# Altium project Learning stand.PrjPcb (part 1 of 2)
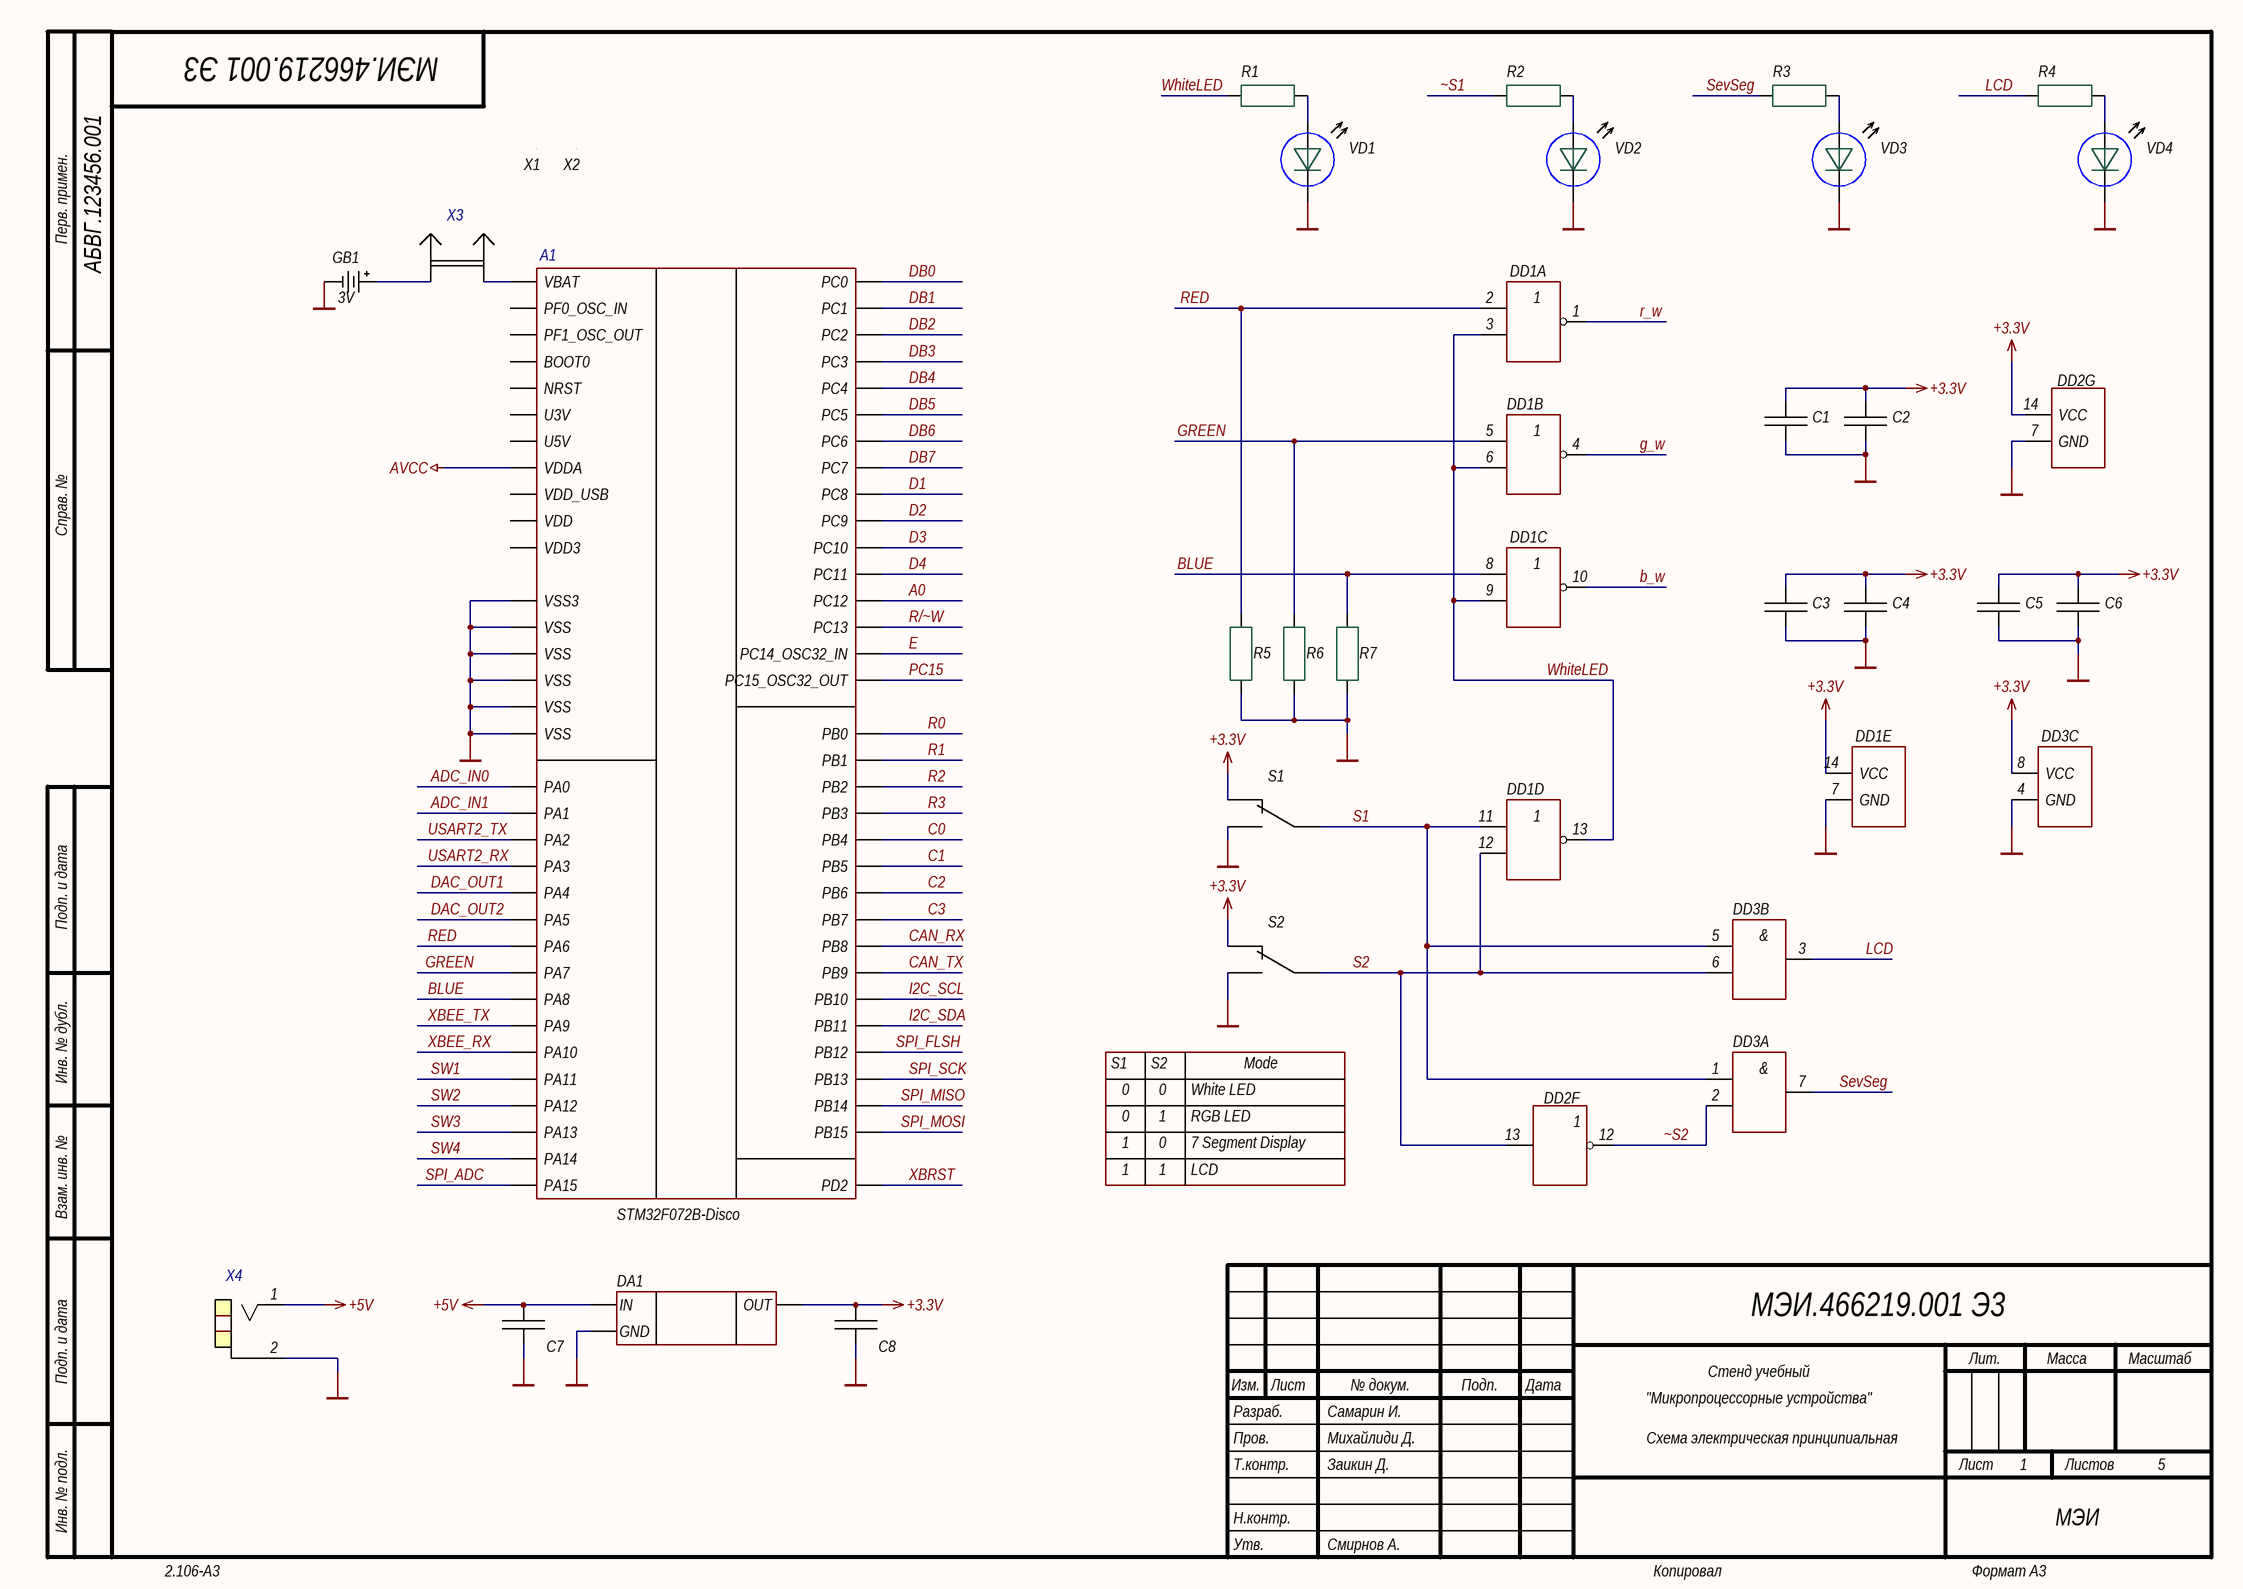
[diagram p0: Microcontroller.SchDoc]
5 sheets, 280 parts. Net scope: global (net labels, ports and power ports of the same name join across sheets).
Board file: PCB.PcbDoc
Sheets:
  Microcontroller.SchDoc
  Peripherals.SchDoc
  Communication.SchDoc
  Displays.SchDoc
  LEDs.SchDoc

## Sheet Microcontroller.SchDoc: Стенд учебный
size 420 x 297 mm; ApprovedBy: Смирнов А.; CheckedBy: Михайлиди Д.; Author: Самарин И.; CompanyName: МЭИ; Address1: Address1; Address2: Address2; Address3: Address3; Address4: Address4; DocumentNumber: МЭИ.466219.001 Э3; SheetNumber: 1; SheetTotal: 5; Title2str: "Микропроцессорные устройства"; ProcessInspection: Заикин Д.; DocumentType: Схема электрическая принципиальная; FirstReferrence: АБВГ.123456.001

### Parts
A1  STM32F072B-Disco  [STM32F072B-Disco]
C1  approved sub OK  [CAPC1608X90N]  (value not drawn)
C2  approved sub OK  [CAPC1608X90N]  (value not drawn)
C3  approved sub OK  [CAPC1608X90N]  (value not drawn)
C4  approved sub OK  [CAPC1608X90N]  (value not drawn)
C5  approved sub OK  [CAPC1608X90N]  (value not drawn)
C6  approved sub OK  [CAPC1608X90N]  (value not drawn)
C7  approved sub OK  [CAPC1608X90N]  (value not drawn)
C8  approved sub OK  [CAPC1608X90N]  (value not drawn)
DA1  ADP3339AKCZ-3.3-RL7  [SOT223]  (value not drawn)
DD1  74LV02D.112  [SOIC127P600X175-14AN]  (value not drawn)  (parts A,B,C,D,E of 5)
DD2  SN74AHCU04DR  [SOIC127P780X200-14N]  (value not drawn)  (parts F,G of 7)
DD3  74LVC2G08DP.125  [TSSOP65P400X110-8N]  (value not drawn)  (parts A,B,C of 3)
GB1  3V  [HU2032-1]
R1  Thick Film  [RESC1608X55N]  (value not drawn)
R2  Thick Film  [RESC1608X55N]  (value not drawn)
R3  Thick Film  [RESC1608X55N]  (value not drawn)
R4  Thick Film  [RESC1608X55N]  (value not drawn)
R5  Thick Film  [RESC1608X55N]  (value not drawn)
R6  Thick Film  [RESC1608X55N]  (value not drawn)
R7  Thick Film  [RESC1608X55N]  (value not drawn)
S1  ON-ON  [SWITCH_SPDT_SLIDER]  (value not drawn)
S2  ON-ON  [SWITCH_SPDT_SLIDER]  (value not drawn)
VD1  FYLS-0603URC  [LED-0603-GREEN]  (value not drawn)
VD2  FYLS-0603URC  [LED-0603-GREEN]  (value not drawn)
VD3  FYLS-0603URC  [LED-0603-GREEN]  (value not drawn)
VD4  FYLS-0603URC  [LED-0603-GREEN]  (value not drawn)
X1  PBS-40  [PBS33]  (value not drawn)
X2  PBS-40  [PBS33]  (value not drawn)
X3  PLS-2  [HDR_1x2]  (value not drawn)
X4  PJ-002A  [CONN_PWR_JACK_2.1x5.5mm]  (value not drawn)

### Nets
+3.3V: C1.1 C2.1 C3.1 C4.1 C5.1 C6.1 C8.1 DA1.2(OUT) DD1.14(VCC) DD2.14(VCC) DD3.8(VCC) S1.3 S2.3
+5V: C7.1 DA1.3(IN) X4.1(VCC)
AVCC: A1.P2_19(VDDA)
GND: A1.P1_2(VSS) A1.P1_9(VSS) A1.P1_19(VSS3) A1.P1_33(VSS) A1.P2_2(VSS) A1.P2_33(VSS) C1.2 C2.2 C3.2 C4.2 C5.2 C6.2 C7.2 C8.2 DA1.1(GND) DD1.7(GND) DD2.7(GND) DD3.4(GND) GB1.GND(MINUS) R5.1 R6.1 R7.1 S1.1 S2.1 VD1.K VD2.K VD3.K VD4.K X4.2(GND)
A0: A1.P2_13(PC12)
ADC_IN0: A1.P1_15(PA0)
ADC_IN1: A1.P1_16(PA1)
b_w: DD1.10(3Y)
BLUE: A1.P2_25(PA8) DD1.8(3A) R7.2
C0: A1.P2_10(PB4)
C1: A1.P2_9(PB5)
C2: A1.P2_8(PB6)
C3: A1.P2_7(PB7)
CAN_RX: A1.P2_4(PB8)
CAN_TX: A1.P2_3(PB9)
D1: A1.P2_27(PC8)
D2: A1.P2_26(PC9)
D3: A1.P2_15(PC10)
D4: A1.P2_14(PC11)
DAC_OUT1: A1.P1_21(PA4)
DAC_OUT2: A1.P1_22(PA5)
DB0: A1.P1_11(PC0)
DB1: A1.P1_12(PC1)
DB2: A1.P1_13(PC2)
DB3: A1.P1_14(PC3)
DB4: A1.P1_25(PC4)
DB5: A1.P1_26(PC5)
DB6: A1.P2_29(PC6)
DB7: A1.P2_28(PC7)
E: A1.P1_5(PC14_OSC32_IN)
g_w: DD1.4(2Y)
GREEN: A1.P1_24(PA7) DD1.5(2A) R6.2
I2C_SCL: A1.P1_30(PB10)
I2C_SDA: A1.P1_31(PB11)
LCD: DD3.3(2Y) R4.1
PC15: A1.P1_6(PC15_OSC32_OUT)
R0: A1.P1_27(PB0)
R1: A1.P1_28(PB1)
R2: A1.P1_29(PB2)
R3: A1.P2_11(PB3)
R/~W: A1.P1_4(PC13)
r_w: DD1.1(1Y)
RED: A1.P1_23(PA6) DD1.2(1A) R5.2
S1: DD1.11(4A) DD3.1(1A) DD3.5(2A) S1.2
S2: DD1.12(4B) DD2.13(6A) DD3.6(2B) S2.2
SevSeg: DD3.7(1Y) R3.1
SPI_ADC: A1.P2_16(PA15)
SPI_FLSH: A1.P1_32(PB12)
SPI_MISO: A1.P2_31(PB14)
SPI_MOSI: A1.P2_30(PB15)
SPI_SCK: A1.P2_32(PB13)
SW1: A1.P2_22(PA11)
SW2: A1.P2_21(PA12)
SW3: A1.P2_20(PA13)
SW4: A1.P2_17(PA14)
USART2_RX: A1.P1_18(PA3)
USART2_TX: A1.P1_17(PA2)
WhiteLED: DD1.3(1B) DD1.6(2A) DD1.9(3B) DD1.13(4Y) R1.1
XBEE_RX: A1.P2_23(PA10)
XBEE_TX: A1.P2_24(PA9)
XBRST: A1.P2_12(PD2)
~S1: R2.1
~S2: DD2.12(6Y) DD3.2(1B)
NetA1_P1_3: A1.P1_3(VBAT) X3.2
NetGB1_VCC: GB1.VCC(PLUS) X3.1
NetR1_2: R1.2 VD1.A(AR)
NetR2_2: R2.2 VD2.A(AR)
NetR3_2: R3.2 VD3.A(AR)
NetR4_2: R4.2 VD4.A(AR)

Not connected (* = marked no-connect by the designer): A1 P1_1(U3V) P1_7(PF0_OSC_IN) P1_8(PF1_OSC_OUT) P1_10(NRST) P1_20(VDD3) P2_1(U5V) P2_5(VDD) P2_6(BOOT0) P2_18(VDD_USB); X1 1(VCC); X2 1(VCC)

### Notes on the sheet
- S1
- S2
- Mode
- 0
- 1
- White LED
- RGB LED
- 7 Segment Display
- LCD
- Перв. примен.
- Справ. №
- Подп. и дата
- Инв. № дубл.
- Взам. инв. №
- Разраб.
- Изм.
- Лист
- № докум.
- Подп.
- Дата
- Лит.
- Масса
- Масштаб
- Пров.
- Т.контр.
- Листов
- Инв. № подл.
- Утв.
- Н.контр.
- 2.106-A3
- Копировал
- Формат А3
- (in symbol 74LVC2G08DP.125, part A) &
- (in symbol 74LVC2G08DP.125, part B) &

### Library data of the parts
A1 = STM32F072B-Disco: The STM32F072 discovery kit; Model: STM32F072B-Disco; ComponentLink1Description: Documentation; ComponentLink1URL: https://www.st.com/content/ccc/resource/technical/document/user_manual/3b/8d/46/57/b7/a9/49/b4/DM00099401.pdf/files/DM00099401.pdf/jcr:content/translations/en.DM00099401.pdf; ComponentLink2Description: KOMPEL; ComponentLink2URL: https://www.compel.ru/infosheet/ST/STM32F072B-DISCO
C1 C3 C5 = CAPC_100n_0603_X7R_50V_10%: Capacitor SMD Cer 100nF 10% 50V X7R 0603; Manufacturer 1: TDK Corporation; Manufacturer Part Number 1: C1608X7R1H104K; Ratings: 50V; X7R; Material: ceramic; SCDType: spec; Value: 100n; Package / Case: 0603 (1608 Metric); Tolerance: ±10%; Supplier 1: Compel; Supplier Part Number 1: *; ComponentLink1URL: https://www.compel.ru/infosheet/TDK/C1608X7R1H104KT; ComponentLink1Description: Compel; Supplier Part Number 2: *
C2 C4 C6 = CAPC_10u_0805_10V: Capacitor SMD Cer 10uF 10% 10V X5R 0603; Manufacturer 1: TDK Corporation; Manufacturer Part Number 1: C1608X5R1A106K080AC; Ratings: 10V; X5R; Material: ceramic; Value: 10µ; SCDType: spec; Package / Case: 0603 (1608 Metric); Tolerance: ±10%; Supplier Part Number 1: *; ComponentLink1URL: https://www.compel.ru/infosheet/TDK/C1608X5R1A106K080AC; ComponentLink1Description: Compel; Supplier 1: Compel
C7 C8 = CAPC_1u_0603_X7R_16V_10%: Capacitor SMD Cer 1uF 10% 16V X7R 0603; Manufacturer 1: TDK Corporation; Manufacturer Part Number 1: C1608X7R1A105K080AC; Ratings: 16V; X7R; Material: ceramic; SCDType: spec; Value: 1µ; Package / Case: 0603 (1608 metric); Tolerance: ±10%; Supplier 1: Compel; Supplier Part Number 1: 445-1604-1-ND; ComponentLink1URL: https://www.compel.ru/infosheet/TDK/C1608X7R1A105K080AC; ComponentLink1Description: Compel
DA1 = ADP3339AKCZ-3.3-RL7: StateVoltageSource; Manufacture: Analog Devices; HelpURL: https://www.compel.ru/infosheet/AD/ADP3339AKCZ-3.3-RL7; Case: SOT-223; Model: ADP3339AKCZ-3.3-RL7
DD1 = 74LV02D.112: 4x2ИЛИ-НЕ; Manufacture: NEXPERIA B.V.; HelpURL: https://www.compel.ru/infosheet/NEX-NXP/74LV02D.112; Case: SO14; Model: 74LV02D.112
DD2 = SN74AHCU04: HEX invertor; Manufacture: TI; HelpURL: https://www.compel.ru/infosheet/TI/SN74AHCU04D; Case: SO-14 (NS); Model: SN74AHCU04DR
DD3 = 74LVC2G08DP.125: 2x2И; Manufacture: NEXPERIA B.V.; HelpURL: https://www.compel.ru/infosheet/NEX-NXP/74LVC2G08DP.125; Case: TSSOP8; Model: 74LVC2G08DP.125
GB1 = Battery: Holder; Value: 3V; Model: HU2032-1; ComponentLink1Description: HolderDatasheet; ComponentLink1URL: https://www.compel.ru/item-pdf/9f8fe22c0277a17744fe21e4a6f50dee/pn/renata~bat-hold.hu2032-lf.pdf; ComponentLink2Description: KOMPEL; ComponentLink2URL: https://www.compel.ru/infosheet/RENATA/BAT%2FHOLD.HU2032-LF
R1-R4 = RES_68R_0603_5%: Resistor SMD chip 68 Ohm 0.1W 5% 0603; Manufacturer 1: Yageo; Manufacturer Part Number 1: RC0603FR-0768RL; Ratings: 1/10 W; Tolerance: ±1%; SCDType: spec; Value: 68R; ComponentLink1Designator: Compel; Package / Case: 0603 (1608 metric); Material: Thick Film; Supplier 1: Compel; Supplier Part Number 1: 311-68GRCT-ND; ComponentLink1URL: https://www.compel.ru/infosheet/YAG/RC0603FR-0768RL
R5-R7 = RES_10K_0603_1%: Resistor SMD chip 10k Ohm 0.1W 1% 0603; Manufacturer 1: Yageo; Manufacturer Part Number 1: RC0603FR-0710KL; Ratings: 1/10W; SCDType: spec; ComponentLink1Designator: Compel; Package / Case: 0603 (1608 Metric); Supplier 1: Compel; Supplier Part Number 1: 311-10.0KHRCT-ND; Tolerance: ±1%; Value: 10K; ComponentLink1URL: https://www.compel.ru/infosheet/YAG/RC0603FR-0710KL
S1 S2 = SW_THD_SPDT_On-On: Switch THD vertical toggle SPDT; Manufacturer 1: TE Connectivity; Manufacturer Part Number 1: SLS121PC04; Contact Rating @ Voltage: 0.25A @ 125VAC; SCDType: spec; ComponentLink1Designator: Compel; Circuit: SPDT; Mounting Type: PCB mount; Supplier 1: Compel; Supplier Part Number 1: 450-1598-ND; Switch Function: On-On; ComponentLink1URL: https://www.compel.ru/infosheet/TE/SLS121PC04
VD1-VD4 = FYLS-0603URC: LED; Manufacture: FORYARD OPTOELECTRONICS CO.,LTD; ComponentLink1Descriptor: Terraelectronica; Model: FYLS-0603URC; Case: L_0603/SMD; ComponentLink1URL: https://www.terraelectronica.ru/product/339750
X1 X2 = CONN Disco: Manufacture: CONNFLY; ComponentLink1Designator: Compel; ComponentLink1URL: https://www.compel.ru/infosheet/CONNFLY/PBS-40; Model: PBS-40
X3 = PLS-2 _1: Jumper; Manufacture: NINGBO KLS Electronic Co.,Ltd.; Model: PLS-2; HelpURL: https://www.compel.ru/infosheet/KLS/PLS-2
X4 = EJ503A (K375A): Power connector; Manufacture: MEMORY PROTECTION Devices Inc.; Model: PJ-002A; HelpURL: https://www.terraelectronica.ru/product/1370664; Case: 5.5*2.1mm

## Sheet Peripherals.SchDoc: Плата отладочная для выполнения лабораторных работ
size 420 x 297 mm; CheckedBy: Смирнов А. Н.; Author: Самарин И. Д.; CompanyName: МЭИ ЭР-02м-18; DrawnBy: Самарин И. Д.; Address1: Address1; Address2: Address2; Address3: Address3; Address4: Address4; DocumentNumber: МЭИ.466219.001 Э3; SheetNumber: 4; Scale: 1:1; Title2str: по курсу "Информационная электроника"; DocumentType: Схема электрическая принципиальная; FirstReferrence: АБВГ.123456.001; DocumentName: Плата отладочная для выполнения лаборторных работ по курсу "Информационная электроника"
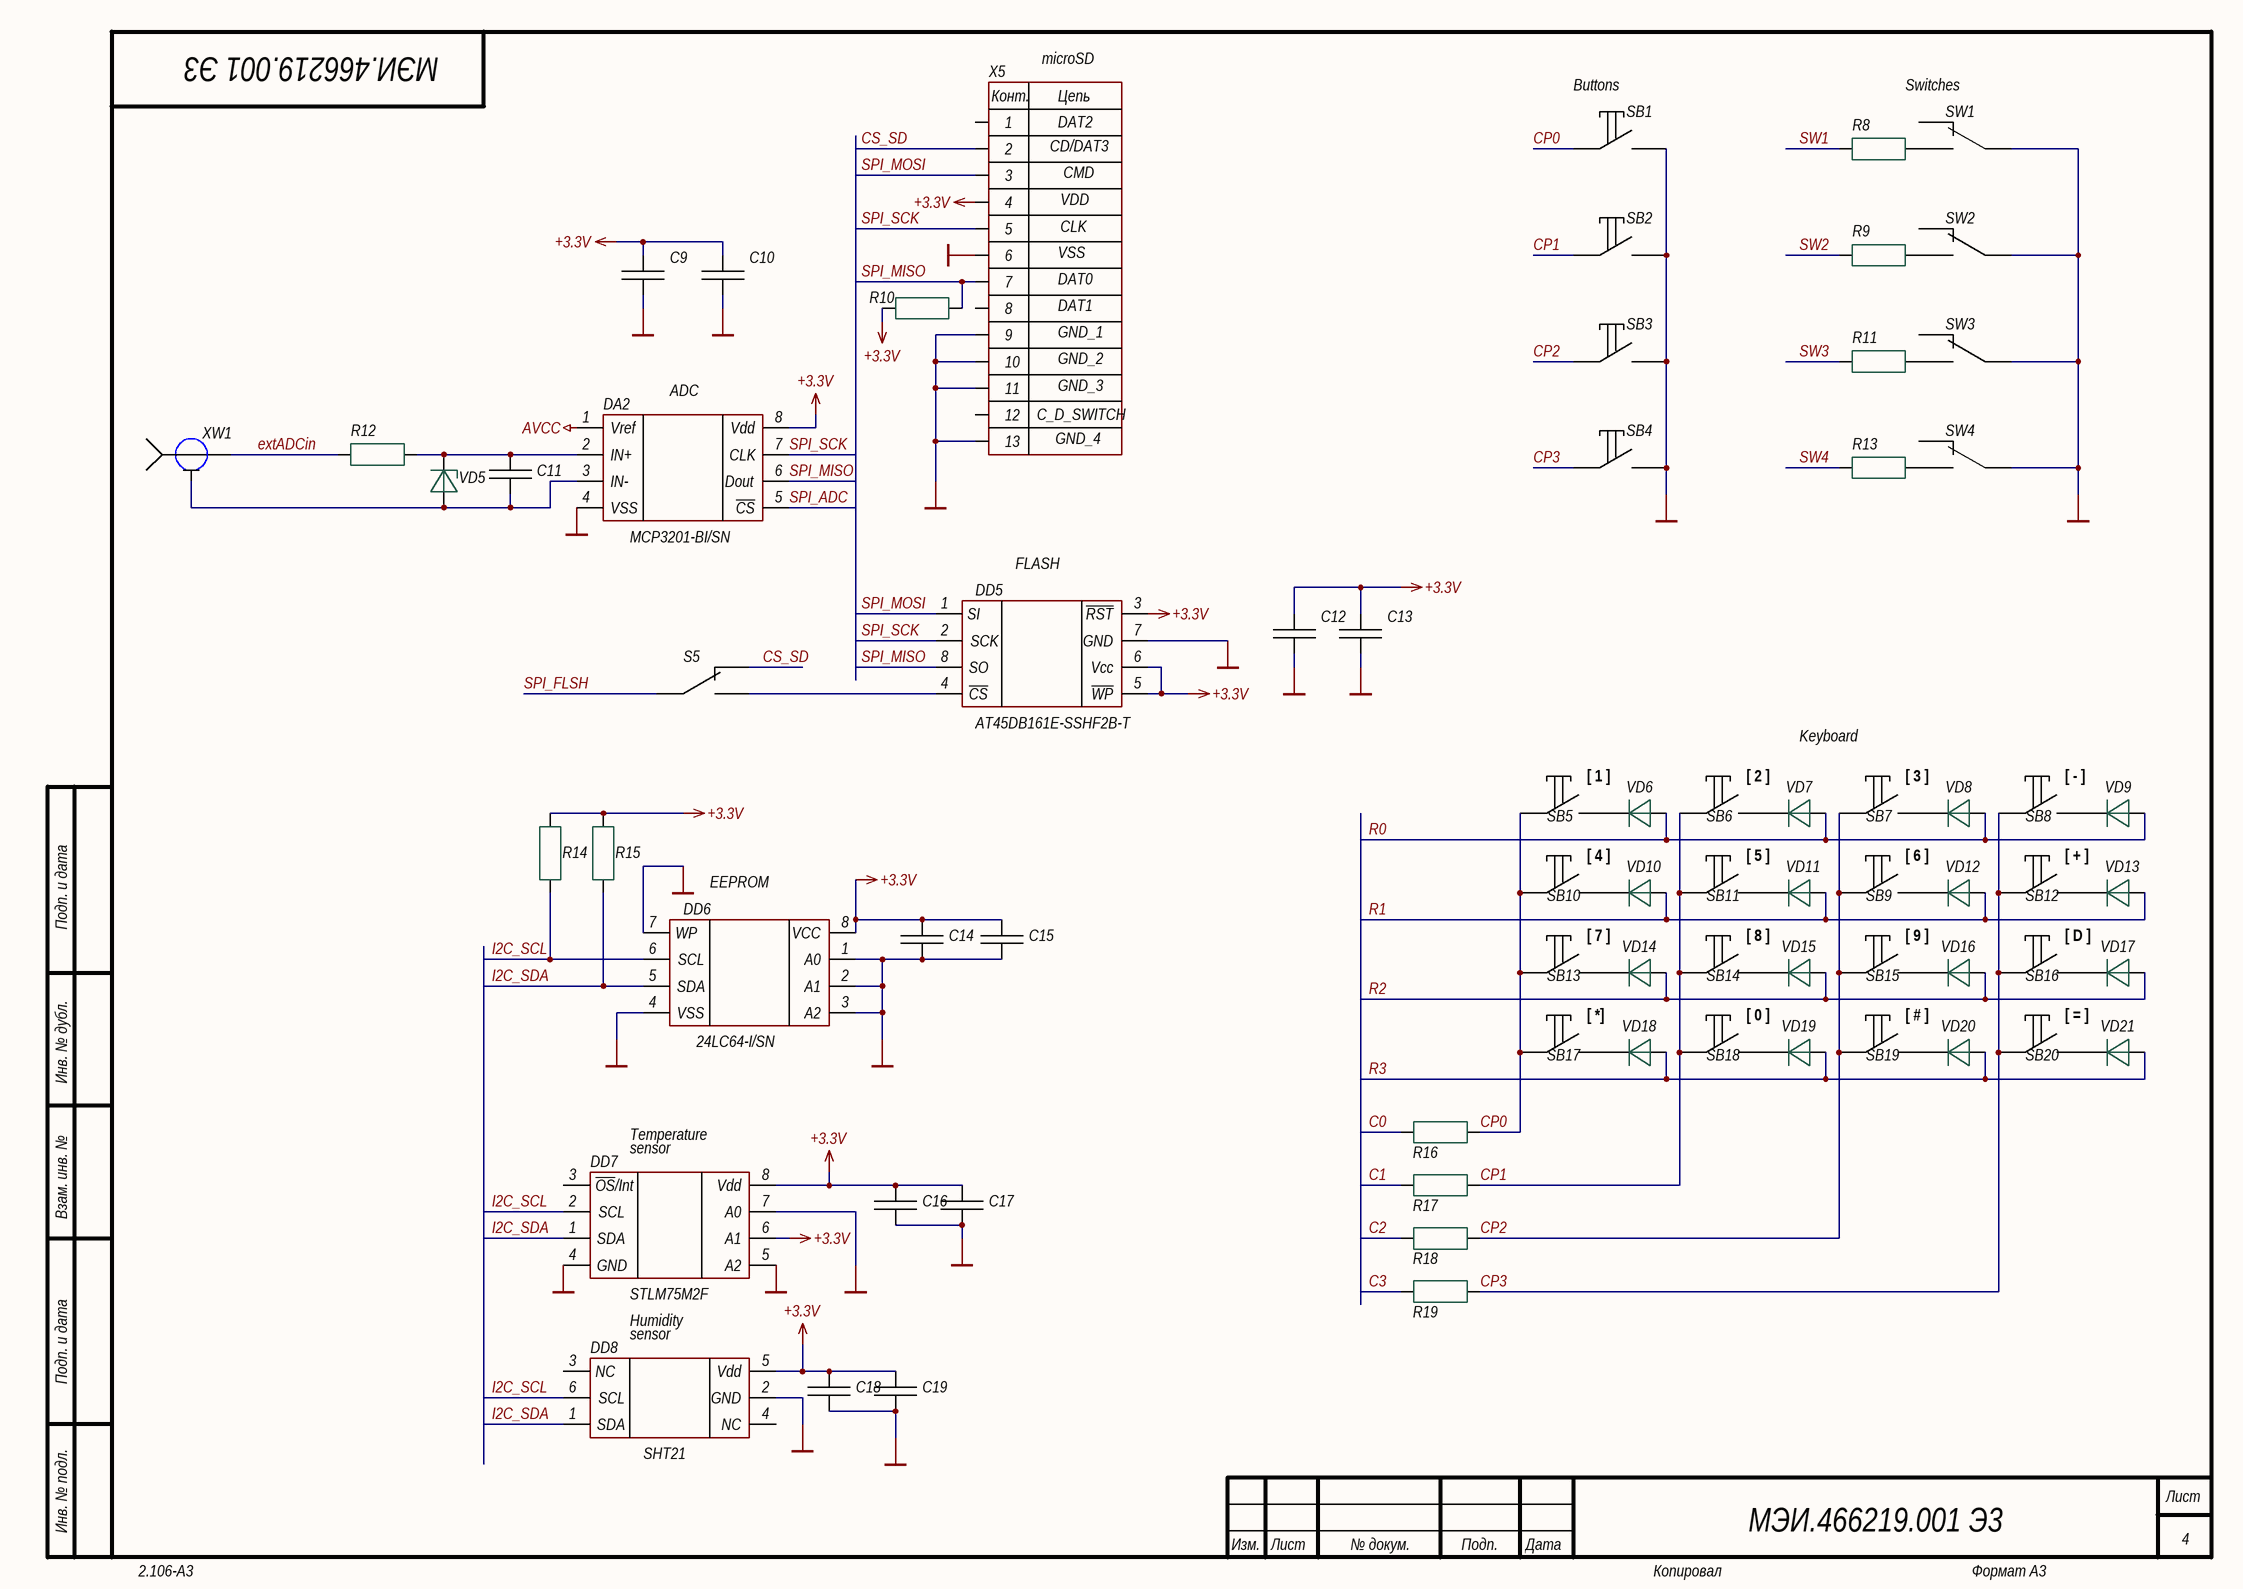
[diagram p1: Peripherals.SchDoc]

### Parts
C9  approved sub OK  [CAPC1608X90N]  (value not drawn)
C10  approved sub OK  [CAPC1608X90N]  (value not drawn)
C11  approved sub OK  [CAPC2012X135N]  (value not drawn)
C12  approved sub OK  [CAPC1608X90N]  (value not drawn)
C13  approved sub OK  [CAPC1608X90N]  (value not drawn)
C14  approved sub OK  [CAPC1608X90N]  (value not drawn)
C15  approved sub OK  [CAPC1608X90N]  (value not drawn)
C16  approved sub OK  [CAPC1608X90N]  (value not drawn)
C17  approved sub OK  [CAPC1608X90N]  (value not drawn)
C18  approved sub OK  [CAPC1608X90N]  (value not drawn)
C19  approved sub OK  [CAPC1608X90N]  (value not drawn)
DA2  MCP3201-BI/SN  [SOIC127P600X175-8AN]
DD5  AT45DB161E-SSHF2B-T  [SOIC127P600X175-8AN]
DD6  24LC64-I/SN  [SOIC127P600X175-8AN]
DD7  STLM75M2F  [SOIC127P600X175-8AN]
DD8  SHT21  [DFN-6]
R8  RC0603FR-071KL  [RESC1608X55N]  (value not drawn)
R9  RC0603FR-071KL  [RESC1608X55N]  (value not drawn)
R10  Thick Film  [RESC1608X55N]  (value not drawn)
R11  RC0603FR-071KL  [RESC1608X55N]  (value not drawn)
R12  RC0603FR-071KL  [RESC1608X55N]  (value not drawn)
R13  RC0603FR-071KL  [RESC1608X55N]  (value not drawn)
R14  Thick Film  [RESC1608X55N]  (value not drawn)
R15  Thick Film  [RESC1608X55N]  (value not drawn)
R16  RC0603FR-071KL  [RESC1608X55N]  (value not drawn)
R17  RC0603FR-071KL  [RESC1608X55N]  (value not drawn)
R18  RC0603FR-071KL  [RESC1608X55N]  (value not drawn)
R19  RC0603FR-071KL  [RESC1608X55N]  (value not drawn)
S5  ON-ON  [SWITCH_SPDT_SLIDER]  (value not drawn)
SB1  SW_THT_PB_4.3mm  [TACT-SWITCH-3-1825910-5]  (value not drawn)
SB2  SW_THT_PB_4.3mm  [TACT-SWITCH-3-1825910-5]  (value not drawn)
SB3  SW_THT_PB_4.3mm  [TACT-SWITCH-3-1825910-5]  (value not drawn)
SB4  SW_THT_PB_4.3mm  [TACT-SWITCH-3-1825910-5]  (value not drawn)
SB5  SW_THT_PB_4.3mm  [TACT-SWITCH-3-1825910-5]  (value not drawn)
SB6  SW_THT_PB_4.3mm  [TACT-SWITCH-3-1825910-5]  (value not drawn)
SB7  SW_THT_PB_4.3mm  [TACT-SWITCH-3-1825910-5]  (value not drawn)
SB8  SW_THT_PB_4.3mm  [TACT-SWITCH-3-1825910-5]  (value not drawn)
SB9  SW_THT_PB_4.3mm  [TACT-SWITCH-3-1825910-5]  (value not drawn)
SB10  SW_THT_PB_4.3mm  [TACT-SWITCH-3-1825910-5]  (value not drawn)
SB11  SW_THT_PB_4.3mm  [TACT-SWITCH-3-1825910-5]  (value not drawn)
SB12  SW_THT_PB_4.3mm  [TACT-SWITCH-3-1825910-5]  (value not drawn)
SB13  SW_THT_PB_4.3mm  [TACT-SWITCH-3-1825910-5]  (value not drawn)
SB14  SW_THT_PB_4.3mm  [TACT-SWITCH-3-1825910-5]  (value not drawn)
SB15  SW_THT_PB_4.3mm  [TACT-SWITCH-3-1825910-5]  (value not drawn)
SB16  SW_THT_PB_4.3mm  [TACT-SWITCH-3-1825910-5]  (value not drawn)
SB17  SW_THT_PB_4.3mm  [TACT-SWITCH-3-1825910-5]  (value not drawn)
SB18  SW_THT_PB_4.3mm  [TACT-SWITCH-3-1825910-5]  (value not drawn)
SB19  SW_THT_PB_4.3mm  [TACT-SWITCH-3-1825910-5]  (value not drawn)
SB20  SW_THT_PB_4.3mm  [TACT-SWITCH-3-1825910-5]  (value not drawn)
SW1  ON-ON  [SWITCH_SPDT_SLIDER]  (value not drawn)
SW2  ON-ON  [SWITCH_SPDT_SLIDER]  (value not drawn)
SW3  ON-ON  [SWITCH_SPDT_SLIDER]  (value not drawn)
SW4  ON-ON  [SWITCH_SPDT_SLIDER]  (value not drawn)
VD5  4V  [SOD323]  (value not drawn)
VD6  1N4148  [SOD523F]  (value not drawn)
VD7  1N4148  [SOD523F]  (value not drawn)
VD8  1N4148  [SOD523F]  (value not drawn)
VD9  1N4148  [SOD523F]  (value not drawn)
VD10  1N4148  [SOD523F]  (value not drawn)
VD11  1N4148  [SOD523F]  (value not drawn)
VD12  1N4148  [SOD523F]  (value not drawn)
VD13  1N4148  [SOD523F]  (value not drawn)
VD14  1N4148  [SOD523F]  (value not drawn)
VD15  1N4148  [SOD523F]  (value not drawn)
VD16  1N4148  [SOD523F]  (value not drawn)
VD17  1N4148  [SOD523F]  (value not drawn)
VD18  1N4148  [SOD523F]  (value not drawn)
VD19  1N4148  [SOD523F]  (value not drawn)
VD20  1N4148  [SOD523F]  (value not drawn)
VD21  1N4148  [SOD523F]  (value not drawn)
X5  DM3CS-SF  [DM3CS-SF]  (value not drawn)
XW1  BNC Fem. 50R  [BNC]  (value not drawn)

### Nets
+3.3V: C9.1 C10.1 C12.1 C13.1 C14.1 C15.1 C16.1 C17.1 C18.1 C19.1 DA2.8(Vdd) DD5.3(~{RST}) DD5.5(~{WP}) DD5.6(Vcc) DD6.8(VCC) DD7.6(A1) DD7.8(Vdd) DD8.5(Vdd) R10.1 R14.2 R15.2 X5.4
AVCC: DA2.1(Vref)
GND: C9.2 C10.2 C12.2 C13.2 C14.2 C15.2 C16.2 C17.2 C18.2 C19.2 DA2.4(VSS) DD5.7(GND) DD6.1(A0) DD6.2(A1) DD6.3(A2) DD6.4(VSS) DD6.7(WP) DD7.4(GND) DD7.5(A2) DD7.7(A0) DD8.2(GND) SB1.2 SB2.2 SB3.2 SB4.2 SW1.2 SW2.2 SW3.2 SW4.2 X5.6 X5.9 X5.10 X5.11 X5.13
C0: R16.1
C1: R17.1
C2: R18.1
C3: R19.1
CP0: R16.2 SB1.1 SB5.1 SB10.1 SB13.1 SB17.1
CP1: R17.2 SB2.1 SB6.1 SB11.1 SB14.1 SB18.1
CP2: R18.2 SB3.1 SB7.1 SB9.1 SB15.1 SB19.1
CP3: R19.2 SB4.1 SB8.1 SB12.1 SB16.1 SB20.1
CS_SD: S5.3 X5.2
extADCin: R12.1 XW1.Sig
I2C_SCL: DD6.6(SCL) DD7.2(SCL) DD8.6(SCL) R14.1
I2C_SDA: DD6.5(SDA) DD7.1(SDA) DD8.1(SDA) R15.1
R0: VD6.A VD7.A VD8.A VD9.A
R1: VD10.A VD11.A VD12.A VD13.A
R2: VD14.A VD15.A VD16.A VD17.A
R3: VD18.A VD19.A VD20.A VD21.A
SPI_ADC: DA2.5(~{CS})
SPI_FLSH: S5.2
SPI_MISO: DA2.6(Dout) DD5.8(SO) R10.2 X5.7
SPI_MOSI: DD5.1(SI) X5.3
SPI_SCK: DA2.7(CLK) DD5.2(SCK) X5.5
SW1: R8.1
SW2: R9.1
SW3: R11.1
SW4: R13.1
NetC11_1: C11.1 DA2.2(IN+) R12.2 VD5.K
NetC11_2: C11.2 DA2.3(IN-) VD5.A XW1.Case
NetDD5_4: DD5.4(~{CS}) S5.1
NetR8_2: R8.2 SW1.1
NetR9_2: R9.2 SW2.1
NetR11_2: R11.2 SW3.1
NetR13_2: R13.2 SW4.1
NetSB5_2: SB5.2 VD6.K
NetSB6_2: SB6.2 VD7.K
NetSB7_2: SB7.2 VD8.K
NetSB8_2: SB8.2 VD9.K
NetSB9_2: SB9.2 VD12.K
NetSB10_2: SB10.2 VD10.K
NetSB11_2: SB11.2 VD11.K
NetSB12_2: SB12.2 VD13.K
NetSB13_2: SB13.2 VD14.K
NetSB14_2: SB14.2 VD15.K
NetSB15_2: SB15.2 VD16.K
NetSB16_2: SB16.2 VD17.K
NetSB17_2: SB17.2 VD18.K
NetSB18_2: SB18.2 VD19.K
NetSB19_2: SB19.2 VD20.K
NetSB20_2: SB20.2 VD21.K

Not connected (* = marked no-connect by the designer): DD7 3(~{OS}/Int); DD8 3(NC) 4(NC); SW1 3; SW2 3; SW3 3; SW4 3; X5 1 8 12

### Notes on the sheet
- microSD
- (near SB1) Buttons
- (near SW1) Switches
- (near DA2) ADC
- (near DD5) FLASH
- [ 1 ]
- [ 2 ]
- Keyboard
- [ 3 ]
- [ - ]
- [ 4 ]
- [ 5 ]
- [ 6 ]
- [ + ]
- (near DD6) EEPROM
- [ 7 ]
- [ 8 ]
- [ 9 ]
- [ D ]
- [ *]
- [ 0 ]
- [ # ]
- [ = ]
- (near DD7) Temperature
- (near DD7) sensor
- Humidity
- (near DD8) sensor
- Подп. и дата
- Инв. № дубл.
- Взам. инв. №
- Инв. № подл.
- Изм.
- Лист
- № докум.
- Подп.
- Дата
- 2.106-A3
- Копировал
- Формат А3
- (in symbol DM3CS-SF) Конт.; Цепь; DAT2; CD/DAT3; CMD; VDD; CLK; VSS; DAT0; DAT1; GND_1; GND_2; GND_3; C_D_SWITCH; GND_4

### Library data of the parts
C9 C12 C14 C16 C18 = CAPC_100n_0603_X7R_50V_10%: as C1 on sheet Microcontroller; Package / Case: 0603 (1608 Metric); Tolerance: ±10%; Supplier 1: Compel; Supplier Part Number 1: *; ComponentLink1URL: https://www.compel.ru/infosheet/TDK/C1608X7R1H104KT; ComponentLink1Description: Compel; Supplier Part Number 2: *
C10 C13 C15 C17 C19 = CAPC_10u_0805_10V: as C2 on sheet Microcontroller; Package / Case: 0603 (1608 Metric); Tolerance: ±10%; Supplier Part Number 1: *; ComponentLink1URL: https://www.compel.ru/infosheet/TDK/C1608X5R1A106K080AC; ComponentLink1Description: Compel; Supplier 1: Compel
C11 = CAPC_330n_0805_X7R_25V_10%: Capacitor SMD Cer 330nF 10% 25V X7R 0805; Manufacturer 1: Kemet; Manufacturer Part Number 1: C0805C334K3RACTU; Ratings: 25V; X7R; Material: ceramic; SCDType: spec; Value: 330n; Package / Case: 0805 (2012 metric); Tolerance: ±10%; ComponentLink1URL: https://www.compel.ru/infosheet/KEM/C0805C334K3RACTU; ComponentLink1Description: Compel; Supplier 1: Compel; Supplier Part Number 1: *
DA2 = MCP3201: ADC; Manufacture: Microchip; HelpURL: http://ww1.microchip.com/downloads/en/devicedoc/21290f.pdf; Case: SOIC; Model: MCP3201-BI/SN; ComponentLink1URL: https://www.compel.ru/infosheet/MCRCH/MCP3201-CI%2FSN; ComponentLink1Description: Compel
DD5 = AT45DB161E: FLASH; Manufacture: Microchip; Case: SO-8 (8S1, 4.80 x 3.81); Model: AT45DB161E-SSHF2B-T; ComponentLink2URL: *; ComponentLink2Description: Datasheet; ComponentLink1Description: Compel
DD6 = 24LC64: EEPROM; Manufacture: Microchip; HelpURL: https://www.compel.ru/item-pdf/39284653603efe9197531fdb9e909a49/pn/mcrch~24aa64t-i-ot.pdf; Case: SOIJ; Model: 24LC64-I/SN
DD7 = STLM75: Temperature sensor; Manufacture: STMicro; HelpURL: https://www.compel.ru/infosheet/ST/STLM75M2F; Case: SO8; Model: STLM75M2F
DD8 = SHT21: Humidity sensor; Manufacture: SENSIRION AG; HelpURL: https://www.compel.ru/infosheet/SENSIR/SHT21; Case: DFN-6; Model: SHT21
R8 R9 R11-R13 R16-R19 = RES_1K_0603_1%: Resistor SMD chip 1k Ohm 0.1W 1% 0603; Manufacturer 1: Yageo; Ratings: 1/10W; SCDType: spec; Package / Case: 0603 (1608 Metric); Manufacturer Part Number 1: RC0603FR-071KL; Supplier 1: Compel; Supplier Part Number 1: 311-1.00KHRCT-ND; Tolerance: ±1%; Value: 1K; ComponentLink1URL: https://www.compel.ru/infosheet/YAG/RC0603FR-071KL; ComponentLink1Description: Compel
R10 = RES_10K_0603_1%: as R5 on sheet Microcontroller; Package / Case: 0603 (1608 Metric); Supplier 1: Compel; Supplier Part Number 1: 311-10.0KHRCT-ND; Tolerance: ±1%; Value: 10K; ComponentLink1URL: https://www.compel.ru/infosheet/YAG/RC0603FR-0710KL
R14 R15 = RES_4K7_0603_1%: Resistor SMD chip 4.7K Ohm 0.1W 1% 0603; Manufacturer Part Number 1: RC0603FR-074K7L; Manufacturer 1: Yageo; Ratings: 1/10W; SCDType: undef; Value: 4K7; ComponentLink1Designator: Compel; Package / Case: 0603 (1608 Metric); Supplier 1: Compel; Supplier Part Number 1: 311-4.70KHRCT-ND; Tolerance: ±1%; ComponentLink1URL: https://www.compel.ru/infosheet/YAG/RC0603FR-074K7L
S5 SW1-SW4 = SW_THD_SPDT_On-On: as S1 on sheet Microcontroller; Circuit: SPDT; Mounting Type: PCB mount; Supplier 1: Compel; Supplier Part Number 1: 450-1598-ND; Switch Function: On-On; ComponentLink1URL: https://www.compel.ru/infosheet/TE/SLS121PC04
SB1-SB4 SB6-SB20 = SW_THT_PB_4.3mm: Switch, tact, 4.3mm stem; Manufacturer 1: TE Connectivity; Manufacturer Part Number 1: 3-1825910-5; SCDType: spec; Function: Speed; ComponentLink1Designator: Compel; Package / Case: 6.5x6.5mm; 4.3mm stem; Material: Brass/Nylon/Ag plating; ComponentLink1URL: https://www.compel.ru/infosheet/TE/3-1825910-5
  SB6: Parameter 1: *; Parameter 2: *
SB5 = SW_THT_PB_4.3mm: Switch, tact, 4.3mm stem; Manufacturer Part Number 1: 3-1825910-5; Number: 1; SCDType: spec; Function: Speed; ComponentLink1Designator: Compel; Package / Case: 6.5x6.5mm; 4.3mm stem; Material: Brass/Nylon/Ag plating; ComponentLink1URL: https://www.compel.ru/infosheet/TE/3-1825910-5; Parameter 1: *
VD5 = DIODE_ZENER_4V_SOD323: Diode Zener SMD 4V 200mW SOD-323; Manufacturer 1: Diotec Semiconductor; Manufacturer Part Number 1: MM3Z3V6; Ratings: 4V; 0.2W;; Material: Si; Tolerance: ±3%; SCDType: source; ComponentLink1Designator: Kompel; Package / Case: SOD-323; Diode Type: Zener; Supplier 1: Kompel; Supplier Part Number 1: MM3Z3V3ST1GOSCT-ND; ComponentLink1URL: https://www.compel.ru/infosheet/DIOTEC/MM3Z3V6
VD6-VD21 = DIODE_1N4148_200mA_SOD523F: Diode SMD small signal 0.2A SOD-523F; Manufacturer 1: Fairchild Semiconductor; Manufacturer Part Number 1: 1N4148WT; Ratings: Vr=75V; Vf=1V@10mA; Io=200mA; Material: Si; SCDType: source; Package / Case: SC-79, SOD-523F; Supplier 1: Digi-Key; Supplier Part Number 1: 1N4148WTCT-ND; ComponentLink1URL: http://www.fairchildsemi.com/ds/1N/1N914BWT.pdf; ComponentLink1Description: http://www.fairchildsemi.com/ds/1N/1N914BWT.pdf; Value: 1N4148
X5 = DM3CS-SF: Connector; Manufacturer_Name: Hirose; ComponentLink1Designator: Compel; Datasheet Link: https://componentsearchengine.com/Datasheets/1/DM3CS-SF.pdf; Mouser2 Part Number: 798-DM3CSSF; Mouser2 Price/Stock: https://www.mouser.com/Search/Refine.aspx?Keyword=798-DM3CSSF; ComponentLink1URL: https://www.compel.ru/infosheet/HI/DM3CS-SF; Model: DM3CS-SF
XW1 = CONN_BNC: BNC; Manufacturer 1: TE Connectivity; Manufacturer Part Number 1: 413969-2; Impedance: 50 Ohm; Ratings: 9400pF; 1500V; SCDType: undef; Category: Connectors; Mounting Type: Through Hole; Supplier 1: Digi-Key; Supplier Part Number 1: A32418-ND; ComponentLink1URL: https://www.compel.ru/infosheet/TE/413969-2; ComponentLink1Description: Compel

## Sheet Communication.SchDoc: Плата отладочная для выполнения лабораторных работ
size 420 x 297 mm; CheckedBy: Смирнов А. Н.; Author: Самарин И. Д.; CompanyName: МЭИ ЭР-02м-18; Address1: Address1; Address2: Address2; Address3: Address3; Address4: Address4; DocumentNumber: МЭИ.466219.001 Э3; SheetNumber: 5; Scale: 1:1; Title2str: по курсу "Информационная электроника"; DocumentType: Схема электрическая принципиальная; FirstReferrence: АБВГ.123456.001
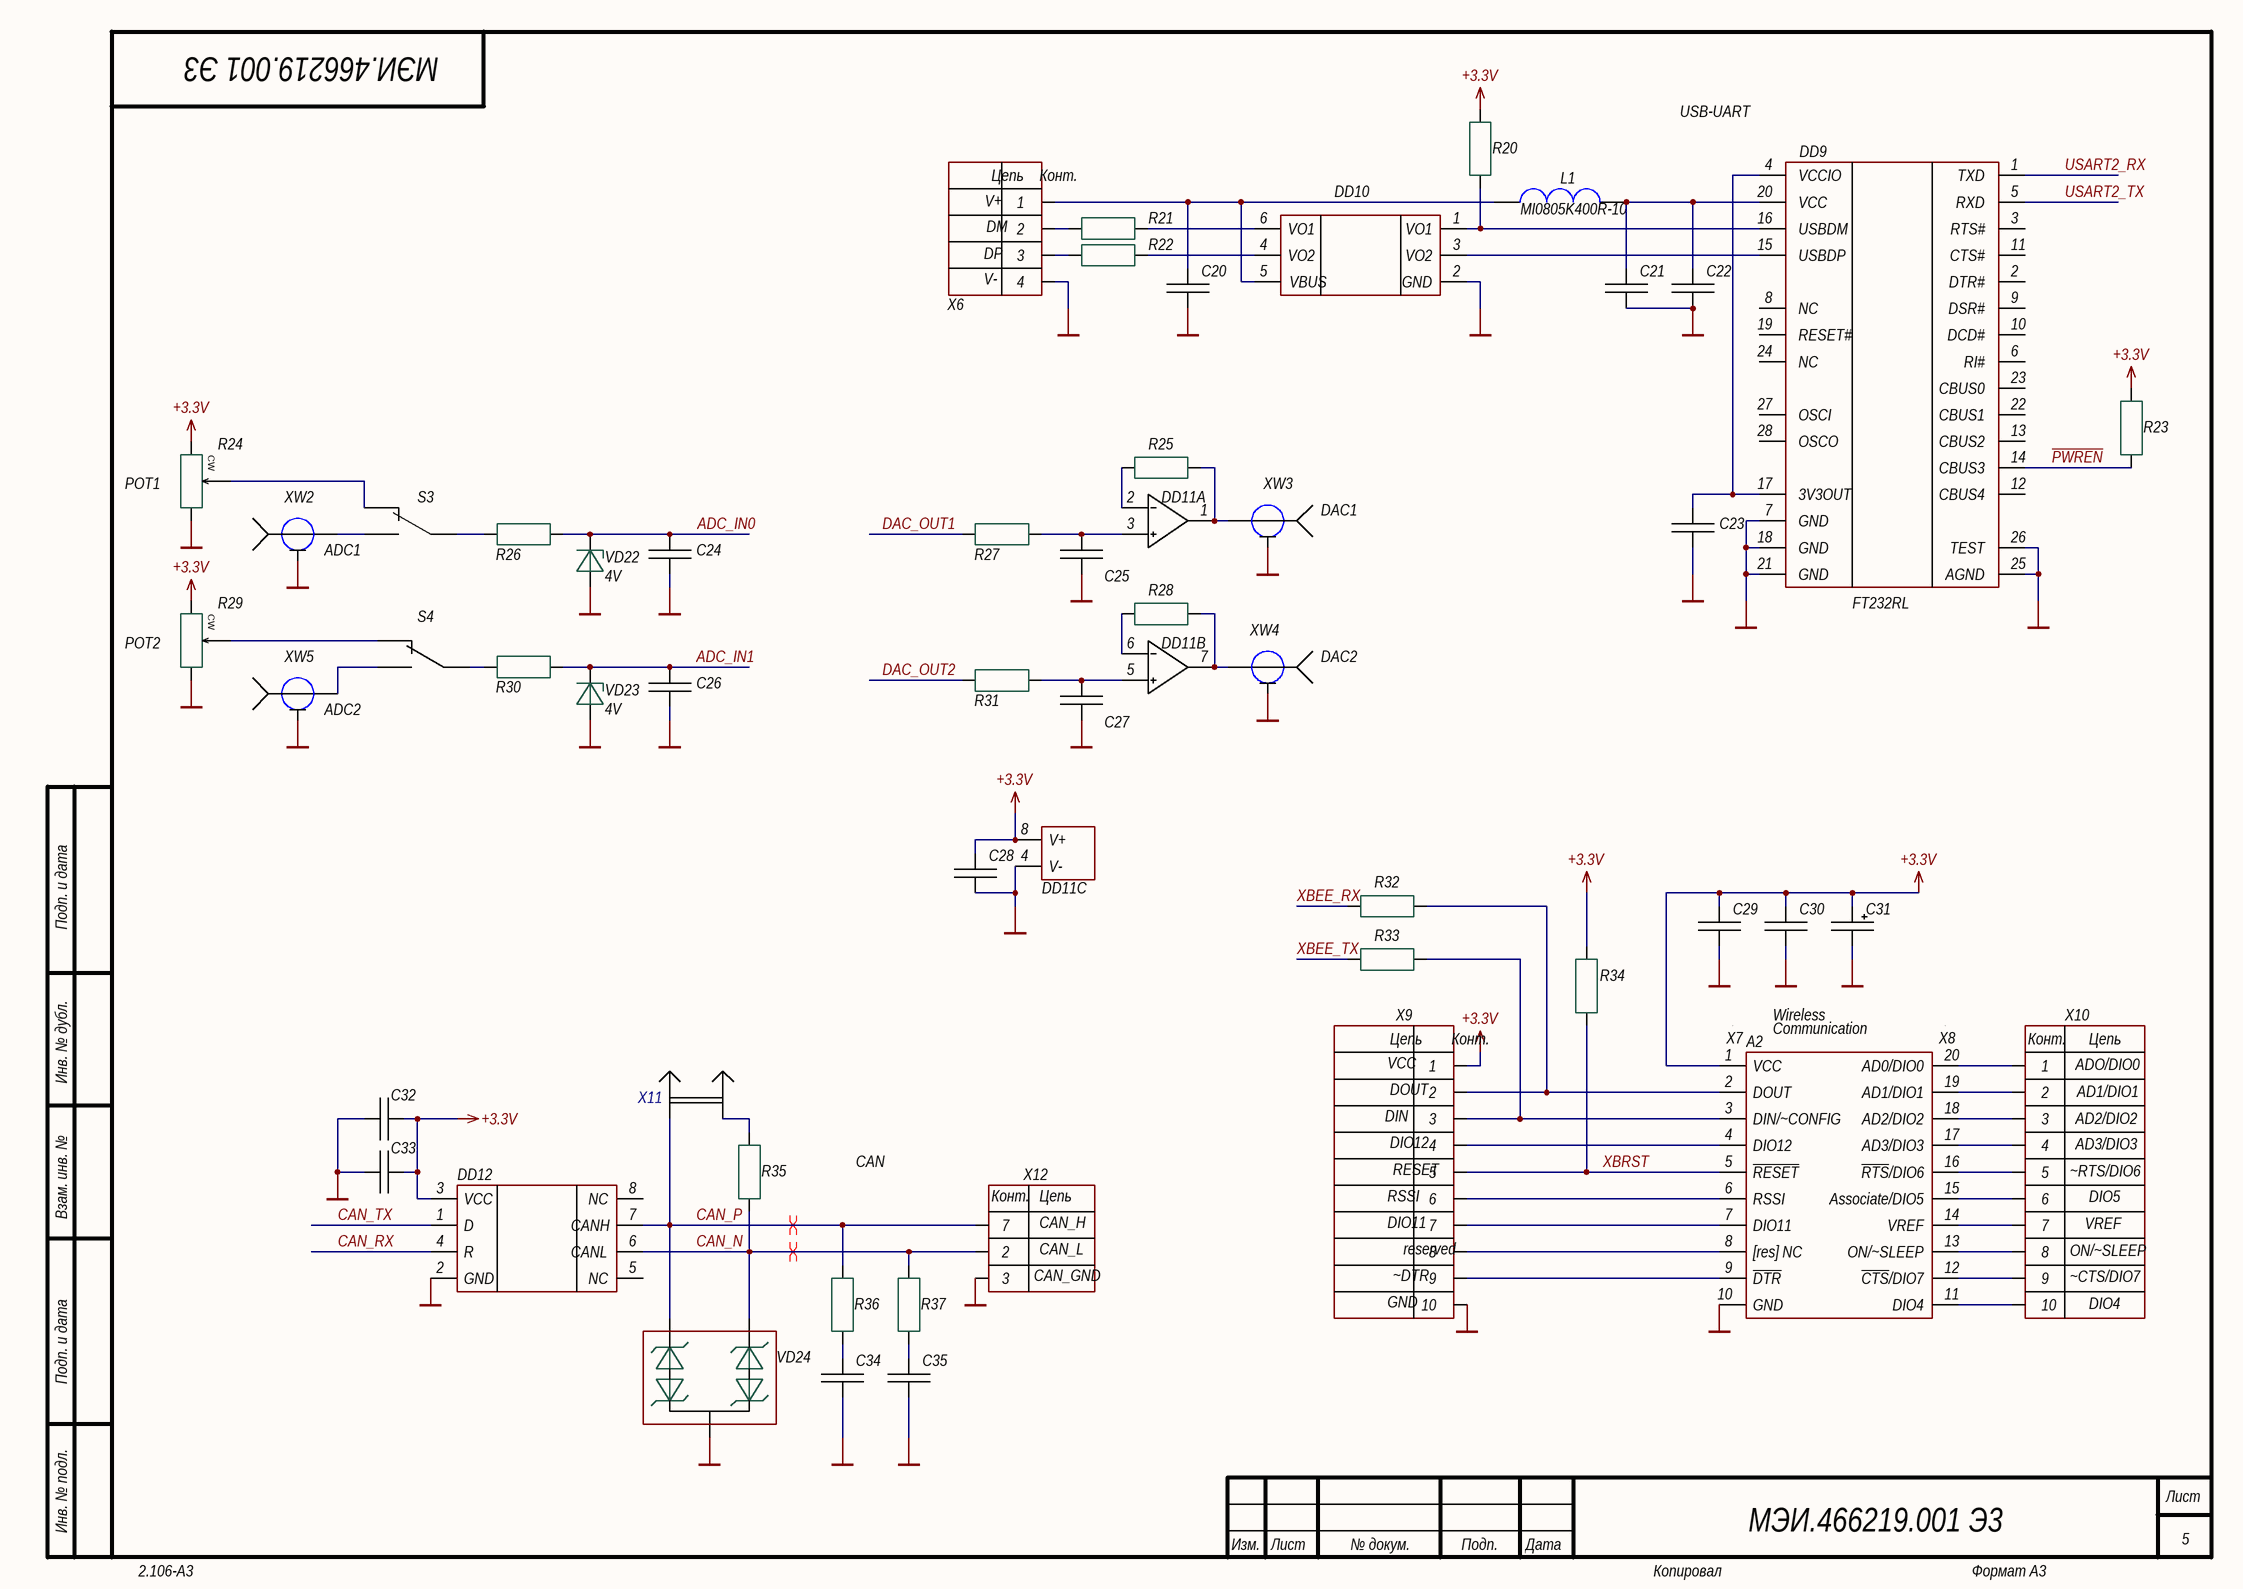
[diagram p2: Communication.SchDoc]

### Parts
A2  *  [XBee Standard]  (value not drawn)
C20  approved sub OK  [CAPC1608X90N]  (value not drawn)
C21  approved sub OK  [CAPC1608X90N]  (value not drawn)
C22  approved sub OK  [CAPC1608X90N]  (value not drawn)
C23  approved sub OK  [CAPC1608X90N]  (value not drawn)
C24  approved sub OK  [CAPC2012X135N]  (value not drawn)
C25  approved sub OK  [CAPC1608X90N]  (value not drawn)
C26  approved sub OK  [CAPC2012X135N]  (value not drawn)
C27  approved sub OK  [CAPC1608X90N]  (value not drawn)
C28  approved sub OK  [CAPC1608X90N]  (value not drawn)
C29  approved sub OK  [CAPC1608X90N]  (value not drawn)
C30  approved sub OK  [CAPC1608X90N]  (value not drawn)
C31  22µ  [CAPMP3216X180N]  (value not drawn)
C32  approved sub OK  [CAPC1608X90N]  (value not drawn)
C33  approved sub OK  [CAPC1608X90N]  (value not drawn)
C34  approved sub OK  [CAPC1608X90N]  (value not drawn)
C35  approved sub OK  [CAPC1608X90N]  (value not drawn)
DD9  FT232RL  [SOP65P780X200-28N]
DD10  USBLC6-2SC6  [SOT23-6]  (value not drawn)
DD11  LMH6646MA/NOPB  [SOIC127P600X175-8AN]  (value not drawn)  (parts A,B,C of 3)
DD12  SN65HVD232D  [SOIC127P600X175-8AN]  (value not drawn)
L1  Manufacturer Part Number 1: MI0805K400R-10  [FBC2012N]  (hidden comment: 2K2 @ 100 MHz)
R20  Thick Film  [RESC1608X55N]  (value not drawn)
R21  Thick Film  [RESC1608X55N]  (value not drawn)
R22  Thick Film  [RESC1608X55N]  (value not drawn)
R23  Thick Film  [RESC1608X55N]  (value not drawn)
R24  RK09K1130A5R  [Trimpot ADC]  (value not drawn)
R25  Thick Film  [RESC1608X55N]  (value not drawn)
R26  RC0603FR-071KL  [RESC1608X55N]  (value not drawn)
R27  RC0603FR-071KL  [RESC1608X55N]  (value not drawn)
R28  Thick Film  [RESC1608X55N]  (value not drawn)
R29  25 turns  [Trimpot ADC]  (value not drawn)
R30  RC0603FR-071KL  [RESC1608X55N]  (value not drawn)
R31  RC0603FR-071KL  [RESC1608X55N]  (value not drawn)
R32  Thick Film  [RESC1608X55N]  (value not drawn)
R33  Thick Film  [RESC1608X55N]  (value not drawn)
R34  Thick Film  [RESC1608X55N]  (value not drawn)
R35  Thick Film  [RESC1608X55N]  (value not drawn)
R36  Thick Film  [RESC1608X55N]  (value not drawn)
R37  Thick Film  [RESC1608X55N]  (value not drawn)
S3  ON-ON  [SWITCH_SPDT_SLIDER]  (value not drawn)
S4  ON-ON  [SWITCH_SPDT_SLIDER]  (value not drawn)
VD22  4V  [SOD323]
VD23  4V  [SOD323]
VD24  SM24CANA  [SOT23-3]  (value not drawn)
X6  USB-B  [USB_TypeB_Tyco]  (value not drawn)
X7  PBS2-10  [PBS2-10]  (value not drawn)
X8  PBS2-10  [PBS2-10]  (value not drawn)
X9  PBS10  [XBCON]  (value not drawn)
X10  PBS10  [XBCON]  (value not drawn)
X11  PLS-2  [HDR_1x2]  (value not drawn)
X12  DRB-9FA  [DB9]  (value not drawn)
XW2  BNC Fem. 50R  [BNC]  (value not drawn)
XW3  BNC Fem. 50R  [BNC]  (value not drawn)
XW4  BNC Fem. 50R  [BNC]  (value not drawn)
XW5  BNC Fem. 50R  [BNC]  (value not drawn)

### Nets
+3.3V: A2.1(VCC) C28.1 C29.1 C30.1 C31.1 C32.2 C33.2 DD11.8(V+) DD12.3(VCC) R20.2 R23.2 R24.CW R29.CW R34.2 X9.1
GND: A2.10(GND) C20.2 C21.2 C22.2 C23.2 C24.2 C25.2 C26.2 C27.2 C28.2 C29.2 C30.2 C31.2 C32.1 C33.1 C34.2 C35.2 DD9.7(GND) DD9.18(GND) DD9.21(GND) DD9.25(AGND) DD9.26(TEST) DD10.2(GND) DD11.4(V-) DD12.2(GND) R24.CCW R29.CCW VD22.A VD23.A VD24.3 X6.4 X9.10 X12.3 XW2.Case XW3.Case XW4.Case XW5.Case
ADC_IN0: C24.1 R26.2 VD22.K
ADC_IN1: C26.1 R30.2 VD23.K
CAN_N: DD12.6(CANL) R35.2 R37.2 VD24.1 X12.2
CAN_P: DD12.7(CANH) R36.2 VD24.2 X11.1 X12.7
CAN_RX: DD12.4(R)
CAN_TX: DD12.1(D)
DAC_OUT1: R27.2
DAC_OUT2: R31.2
~{PWREN}: DD9.14(CBUS3) R23.1
USART2_RX: DD9.1(TXD)
USART2_TX: DD9.5(RXD)
XBEE_RX: R32.1
XBEE_TX: R33.1
XBRST: A2.5(~{RESET}) R34.1 X9.5
NetA2_2: A2.2(DOUT) R32.2 X9.2
NetA2_3: A2.3(DIN/~CONFIG) R33.2 X9.3
NetA2_4: A2.4(DIO12) X9.4
NetA2_6: A2.6(RSSI) X9.6
NetA2_7: A2.7(DIO11) X9.7
NetA2_8: A2.8([res]_NC) X9.8
NetA2_9: A2.9(~{DTR}) X9.9
NetA2_11: A2.11(DIO4) X10.10
NetA2_12: A2.12(~{CTS}/DIO7) X10.9
NetA2_13: A2.13(ON/~SLEEP) X10.8
NetA2_14: A2.14(VREF) X10.7
NetA2_15: A2.15(Associate/DIO5) X10.6
NetA2_16: A2.16(~{RTS}/DIO6) X10.5
NetA2_17: A2.17(AD3/DIO3) X10.4
NetA2_18: A2.18(AD2/DIO2) X10.3
NetA2_19: A2.19(AD1/DIO1) X10.2
NetA2_20: A2.20(AD0/DIO0) X10.1
NetC20_1: C20.1 DD10.5(VBUS) L1.1(B) X6.1
NetC21_1: C21.1 C22.1 DD9.20(VCC) L1.2(CB)
NetC23_1: C23.1 DD9.4(VCCIO) DD9.17(3V3OUT)
NetC25_1: C25.1 DD11.3(+IN_A) R27.1
NetC27_1: C27.1 DD11.5(+IN_B) R31.1
NetC34_1: C34.1 R36.1
NetC35_1: C35.1 R37.1
NetDD9_15: DD9.15(USBDP) DD10.3(VO2)
NetDD9_16: DD9.16(USBDM) DD10.1(VO1) R20.1
NetDD10_4: DD10.4(VO2) R22.2
NetDD10_6: DD10.6(VO1) R21.2
NetDD11_1: DD11.1(OUT_A) R25.2 XW3.Sig
NetDD11_2: DD11.2(-IN_A) R25.1
NetDD11_6: DD11.6(-IN_B) R28.1
NetDD11_7: DD11.7(OUT_B) R28.2 XW4.Sig
NetR21_1: R21.1 X6.2
NetR22_1: R22.1 X6.3
NetR24_W: R24.W S3.3
NetR26_1: R26.1 S3.2
NetR29_W: R29.W S4.3
NetR30_1: R30.1 S4.2
NetR35_1: R35.1 X11.2
NetS3_1: S3.1 XW2.Sig
NetS4_1: S4.1 XW5.Sig

Not connected (* = marked no-connect by the designer): DD9 2(DTR#) 3(RTS#) 6(RI#) 8(NC) 9(DSR#) 10(DCD#) 11(CTS#) 12(CBUS4) 13(CBUS2) 19(RESET#) 22(CBUS1) 23(CBUS0) 24(NC) 27(OSCI) 28(OSCO); DD12 5(NC) 8(NC); X7 1(VCC); X8 1(VCC)

### Layout directives
differential pair: CAN_N, CAN_P

### Notes on the sheet
- USB-UART
- (near R24) POT1
- (near XW3) DAC1
- ADC1
- (near R29) POT2
- (near XW4) DAC2
- (near XW5) ADC2
- Wireless
- Communication
- CAN
- Подп. и дата
- Инв. № дубл.
- Взам. инв. №
- Инв. № подл.
- Изм.
- Лист
- № докум.
- Подп.
- Дата
- 2.106-A3
- Копировал
- Формат А3
- (in symbol DRB-9FA_1) Конт.; Цепь; CAN_H; CAN_L; CAN_GND
- (in symbol USB_TypeB) Цепь; Конт.; V+; DM; DP; V-
- (in symbol XBEE connector) Конт.; Цепь; ADO/DIO0; AD1/DIO1; AD2/DIO2; AD3/DIO3; ~RTS/DIO6; DIO5; VREF; ON/~SLEEP; ~CTS/DIO7; DIO4
- (in symbol XBEE connector_left) Цепь; Конт.; VCC; DOUT; DIN; DIO12; RESET; RSSI; DIO11; reserved; ~DTR; GND

### Library data of the parts
A2 = IC-RADIO-XBEE: XBEE module; ComponentLink1Designator: Compel; Model: *; ComponentLink1URL: *
C20 = CAPC_10n_0603_X7R_50V_10%: Capacitor SMD Cer 10nF 10% 50V X7R 0603; Manufacturer 1: TDK Corporation; Manufacturer Part Number 1: C1608X7R1H103K; Ratings: 50V; X7R; Material: ceramic; SCDType: spec; Value: 10n; Package / Case: 0603 (1608 metric); Tolerance: ±10%; Supplier 1: Digi-Key; Supplier Part Number 1: 445-1311-1-ND; ComponentLink1URL: http://product.tdk.com/capacitor/mlcc/en/documents/mlcc_commercial_general_en.pdf; ComponentLink1Description: http://product.tdk.com/capacitor/mlcc/en/documents/mlcc_commercial_general_en.pdf; Supplier 2: Digi-Key; Supplier Part Number 2: 478-1227-1-ND; Manufacturer 2: AVX Corporation; Manufacturer Part Number 2: 06035C103KAT2A; ComponentLink2URL: https://www.compel.ru/infosheet/TDK/C1608X7R1H103K080AA; ComponentLink2Description: Compel
C21 C23 C28 C29 C32 = CAPC_100n_0603_X7R_50V_10%: as C1 on sheet Microcontroller; Package / Case: 0603 (1608 Metric); Tolerance: ±10%; Supplier 1: Compel; Supplier Part Number 1: *; ComponentLink1URL: https://www.compel.ru/infosheet/TDK/C1608X7R1H104KT; ComponentLink1Description: Compel; Supplier Part Number 2: *
C22 = CAPC_4u7_0603: Capacitor SMD Cer 4.7uF 10% 16V X5R 0805; Manufacturer 1: TDK Co.; Manufacturer Part Number 1: C1608X5R1E475K080AC; Ratings: 25V; X5R; Material: ceramic; SCDType: spec; Value: 4µ7; Package / Case: 0603 (1608 Metric); Tolerance: ±10%; Supplier 1: Digi-Key; Supplier Part Number 1: 587-1294-1-ND; Operating Temperature: -55°C ~ 85°C; Size / Dimension: 0.079" L x 0.049" W (2.00mm x 1.25mm); Thickness (Max): 0.053" (1.35mm); ComponentLink1URL: https://www.compel.ru/infosheet/TDK/C1608X5R1E475K080AC; ComponentLink1Description: Compel; Supplier 2: Digi-Key; Supplier Part Number 2: 1276-1065-1-ND; Manufacturer 2: Samsung Electro-Mechanics America, Inc; Manufacturer Part Number 2: CL21A475KOFNNNE; RoHS 2: RoHS Compliant; ComponentLink2URL: http://www.samsungsem.com/servlet/FileDownload?type=spec&file=CL21A475KOFNNNE.pdf; ComponentLink2Description: http://www.samsungsem.com/servlet/FileDownload?type=spec&file=CL21A475KOFNNNE.pdf; Supplier 3: Digi-Key; Supplier Part Number 3: 399-8101-1-ND; Manufacturer 3: Kemet; Manufacturer Part Number 3: C0805C475K4PACTU; RoHS 3: RoHS Compliant; ComponentLink3URL: http://capacitoredge.kemet.com/capedge2/DataSheet?pn=C0805C475K4PACTU; ComponentLink3Description: http://capacitoredge.kemet.com/capedge2/DataSheet?pn=C0805C475K4PACTU; Supplier 4: Digi-Key; Supplier Part Number 4: 490-7215-1-ND; Manufacturer 4: Murata Electronics North America; Manufacturer Part Number 4: GRM21BR61C475MA88L; RoHS 4: RoHS Compliant; ComponentLink4URL: http://psearch.murata.com/capacitor/product/GRM21BR61C475MA88#.pdf; ComponentLink4Description: http://psearch.murata.com/capacitor/product/GRM21BR61C475MA88#.pdf; Supplier 5: Digi-Key; Supplier Part Number 5: 445-7640-1-ND; Manufacturer 5: Taiyo Yuden; Manufacturer Part Number 5: EMK212BJ475KG-T; RoHS 5: RoHS Compliant; ComponentLink5URL: http://www.yuden.co.jp/productdata/catalog/en/mlcc01_e.pdf; ComponentLink5Description: http://www.yuden.co.jp/productdata/catalog/en/mlcc01_e.pdf; RoHS 1: RoHS Compliant
C24 C26 = CAPC_330n_0805_X7R_25V_10%: as C11 on sheet Peripherals; Package / Case: 0805 (2012 metric); Tolerance: ±10%; ComponentLink1URL: https://www.compel.ru/infosheet/KEM/C0805C334K3RACTU; ComponentLink1Description: Compel; Supplier 1: Compel; Supplier Part Number 1: *
C25 C27 = CAPC_1u_0603_X7R_16V_10%: as C7 on sheet Microcontroller; Package / Case: 0603 (1608 metric); Tolerance: ±10%; Supplier 1: Compel; Supplier Part Number 1: 445-1604-1-ND; ComponentLink1URL: https://www.compel.ru/infosheet/TDK/C1608X7R1A105K080AC; ComponentLink1Description: Compel
C30 C33 = CAPC_10u_0805_10V: as C2 on sheet Microcontroller; Package / Case: 0603 (1608 Metric); Tolerance: ±10%; Supplier Part Number 1: *; ComponentLink1URL: https://www.compel.ru/infosheet/TDK/C1608X5R1A106K080AC; ComponentLink1Description: Compel; Supplier 1: Compel
C31 = CAPT_22u_3216_6V3: Capacitor SMD Tantalum 22uF 10% 6.3V 3216-18; Manufacturer 1: Kemet; Manufacturer Part Number 1: T491A226K006AT; Material: Solid Tantalum; SCDType: source; Package / Case: EIA 535BAAC size A; Ratings: 6.3V; Tolerance: ±10%; Supplier 1: Digi-Key; Supplier Part Number 1: 399-8279-1-ND; ComponentLink1URL: https://www.compel.ru/infosheet/KEM/T491A226K006AT; ComponentLink1Description: Compel; Supplier 2: Digi-Key; Supplier Part Number 2: 718-1139-1-ND; Manufacturer 2: Vishay Sprague; Manufacturer Part Number 2: 293D226X96R3A2TE3; ComponentLink2URL: http://www.vishay.com/doc?40002; ComponentLink2Description: http://www.vishay.com/doc?40002; Supplier 3: Digi-Key; Supplier Part Number 3: 478-3865-1-ND; Manufacturer 3: AVX Corporation; Manufacturer Part Number 3: TAJA226K006RNJ; ComponentLink3URL: http://www.avx.com/docs/Catalogs/taj.pdf; ComponentLink3Description: http://www.avx.com/docs/Catalogs/taj.pdf; Value: 22µ
C34 C35 = CAPC_560p_0603_NP0_50V_5%: Capacitor SMD Cer 560pF 5% 50V NP0 0603; Manufacturer 1: KEMET; Manufacturer Part Number 1: C0603C561K8RACTU; Ratings: 10V; Material: ceramic; Capacitance: 470pF; SCDType: spec; Value: 560p; Package / Case: 0603 (1608 metric); Voltage - Rated: 50V; Mounting Type: Surface Mount, MLCC; Operating Temperature: -55°C ~ 125°C; Applications: General Purpose; Size / Dimension: 0.063" L x 0.032" W (1.60mm x 0.81mm); Height - Seated (Max): -; Thickness (Max): 0.035" (0.90mm); Lead Spacing: -; Lead Style: -; ComponentLink1URL: https://www.compel.ru/infosheet/KEM/C0603C561K8RACTU; ComponentLink1Description: Compel; Tolerance: ±5%; Supplier Part Number: *; Supplier 1: Compel
DD9 = FT232: USB-UART converter; Manufacture: FUTURE Technology Devices Int. Ltd.; HelpURL: https://www.compel.ru/infosheet/FTDI/FT232RLR-C; Case: SSOP-28; Model: FT232RL
DD10 = USBLC6-2SC6: Protect; Manufacture: ST Microelectronics; HelpURL: https://www.compel.ru/infosheet/ST/USBLC6-2SC6; Case: SOT236; Model: USBLC6-2SC6
DD11 = LMH6646: Rail-to-Rail Input and Output Amplifiers  with Shutdown Option; Manufacture: TI; HelpURL: *; Case: SOIC-8 (D0008A, 4.9 x 3.9); Model: LMH6646MA/NOPB
DD12 = SN65HVD230 3.3-V: Protect; Manufacture: TI; HelpURL: https://www.compel.ru/infosheet/TI/SN65HVD232D; Case: so-8; Model: SN65HVD232D
L1 = FERRITE_MI0805K400R-10_0805: Ferrite bead 2.2K Ohm at 100 MHz 200mA 0603 SMD; Manufacturer 1: STEWARD Inc.; Ratings: 200 mA; 800 mOhm DC; SCDType: source; Size / Dimension: 0805; Impedance @ Frequency: *; Current Rating: *; DC Resistance (DCR): *; Filter Type: *; Package / Case: 0805; Height (Max): *; Mounting Type: Surface Mount; Supplier 1: Digi-Key; Supplier Part Number 1: 445-8671-1-ND; RoHS 1: RoHS Compliant; ComponentLink1URL: https://www.compel.ru/infosheet/STEWARD/MI0805K400R-10; ComponentLink1Description: Compel; Value: 2K2 @ 100 MHz
R20 = RES_4K7_0603_1%: as R14 on sheet Peripherals; Package / Case: 0603 (1608 Metric); Supplier 1: Compel; Supplier Part Number 1: 311-4.70KHRCT-ND; Tolerance: ±1%; ComponentLink1URL: https://www.compel.ru/infosheet/YAG/RC0603FR-074K7L
R21 R22 R32 R33 = RES_22R_0603_5%: Resistor SMD chip 22 Ohm 0.1W 5% 0603; Manufacturer 1: Yageo; Manufacturer Part Number 1: RC0603JR-0722RL; Tolerance: ±1%; Ratings: 1/10W; SCDType: spec; Temperature Coefficient: ±100ppm/°C; Value: 22R; Package / Case: 0603 (1608 metric); Case: 0603 (1608 metric); Supplier 1: Compel; Supplier Part Number 1: RC0603FR-0722RL; RoHS 1: RoHS Compliant; ComponentLink1URL: https://www.compel.ru/infosheet/YAG/RC0603FR-0722RL; ComponentLink1Description: Compel; Supplier 2: Digi-Key; Supplier Part Number 2: 1276-5022-6-ND; Manufacturer 2: Samsung Electro-Mechanics America, Inc; Manufacturer Part Number 2: RC1608J220CS; RoHS 2: RoHS Compliant; ComponentLink2URL: http://www.samsungsem.com/servlet/FileDownload?filename=productcatalog/pdf/Chip_Resistor.pdf; ComponentLink2Description: http://www.samsungsem.com/servlet/FileDownload?filename=productcatalog/pdf/Chip_Resistor.pdf; Supplier 3: Digi-Key; Supplier Part Number 3: RMCF0603JT22R0DKR-ND; Manufacturer 3: Stackpole Electronics Inc; Manufacturer Part Number 3: RMCF0603JT22R0; RoHS 3: RoHS Compliant; ComponentLink3URL: http://www.seielect.com/Catalog/SEI-RMCF_RMCP.pdf; ComponentLink3Description: http://www.seielect.com/Catalog/SEI-RMCF_RMCP.pdf; Supplier 4: Digi-Key; Supplier Part Number 4: RHM22CGDKR-ND; Manufacturer 4: Rohm Semiconductor; Manufacturer Part Number 4: MCR03ERTJ220; RoHS 4: RoHS Compliant; ComponentLink4URL: http://rohmfs.rohm.com/en/products/databook/datasheet/passive/resistor/chip_resistor/mcr_g.pdf; ComponentLink4Description: http://rohmfs.rohm.com/en/products/databook/datasheet/passive/resistor/chip_resistor/mcr_g.pdf; Supplier 5: Digi-Key; Supplier Part Number 5: P22GDKR-ND; Manufacturer 5: Panasonic Electronic Components; Manufacturer Part Number 5: ERJ-3GEYJ220V; RoHS 5: RoHS Compliant; ComponentLink5URL: http://industrial.panasonic.com/www-cgi/jvcr13pz.cgi?E+PZ+3+AOA0001+ERJ3GEYJ220V+7+WW; ComponentLink5Description: http://industrial.panasonic.com/www-cgi/jvcr13pz.cgi?E+PZ+3+AOA0001+ERJ3GEYJ220V+7+WW
R23 R34 = RES_10K_0603_1%: as R5 on sheet Microcontroller; Package / Case: 0603 (1608 Metric); Supplier 1: Compel; Supplier Part Number 1: 311-10.0KHRCT-ND; Tolerance: ±1%; Value: 10K; ComponentLink1URL: https://www.compel.ru/infosheet/YAG/RC0603FR-0710KL
R24 = RES_TRIMMER_10K_ADC: Trimmer THD 20K 500mW 25-turn; Manufacturer 1: ALPS Electric Co., Ltd.; Tolerance: ±20%; Ratings: 1/2W; ±100ppm/°C; SCDType: spec; ComponentLink1Designator: Compel; Value: 10K; Material: Cermet; Package / Case: 10.9mm L x 5.0mm W x 10.0mm H; Supplier 1: Kompel; Supplier Part Number 1: 490-2900-ND; Manufacturer Part Number 1: RK09K1130A5R; ComponentLink1URL: https://www.compel.ru/infosheet/ALPS/RK09K1130A5R
R25 R28 R36 R37 = RES_100R_0603_1%: Resistor SMD chip 100 Ohm 0.1W 1% 0603; Manufacturer 1: Yageo; Manufacturer Part Number 1: RC0603FR-07100RL; Ratings: 1/10 W; SCDType: spec; Value: 100R; Package / Case: 0603 (1608 Metric); Material: Thick Film; Supplier 1: Compel; Supplier Part Number 1: 311-100HRCT-ND; Supplier 2: Digi-Key; Supplier Part Number 2: P100HTR-ND; Manufacturer 2: Panasonic - ECG; Manufacturer Part Number 2: ERJ-3EKF1000V; ComponentLink1URL: https://www.compel.ru/infosheet/YAG/RC0603FR-07100RL; ComponentLink1Description: Compel; Tolerance: ±1%
R26 R27 R30 R31 = RES_1K_0603_1%: as R8 on sheet Peripherals; Package / Case: 0603 (1608 Metric); Manufacturer Part Number 1: RC0603FR-071KL; Supplier 1: Compel; Supplier Part Number 1: 311-1.00KHRCT-ND; Tolerance: ±1%; Value: 1K; ComponentLink1URL: https://www.compel.ru/infosheet/YAG/RC0603FR-071KL; ComponentLink1Description: Compel
R29 = RES_TRIMMER_10K_ADC: Trimmer THD 20K 500mW 25-turn; Manufacturer 1: ALPS Electric Co., Ltd.; Manufacturer Part Number 1: RK09K1130A5R; Tolerance: ±20%; Ratings: 1/2W; ±100ppm/°C; SCDType: spec; ComponentLink1Designator: Compel; Value: 10K; Material: Cermet; Package / Case: 10.9mm L x 5.0mm W x 10.0mm H; Supplier 1: Kompel; Supplier Part Number 1: 490-2900-ND; ComponentLink1URL: https://www.compel.ru/infosheet/ALPS/RK09K1130A5R
R35 = RES_120R_0603_5%: Resistor SMD chip 120 Ohm 0.1W 5% 0603; Manufacturer 1: Yageo; Manufacturer Part Number 1: RC0603FR-07120RL; Ratings: 1/10 W; Tolerance: ±1%; SCDType: spec; Value: 120R; Package / Case: 0603 (1608 metric); Material: Thick Film; Supplier 1: Compel; Supplier Part Number 1: 541-120GCT-ND; ComponentLink1URL: http://www.vishay.com/doc?20035; ComponentLink1Description: Compel; Supplier 2: Digi-Key; Supplier Part Number 2: 311-120GRCT-ND; Manufacturer 2: Yageo; Manufacturer Part Number 2: *; ComponentLink2URL: http://www.yageo.com/documents/recent/PYu-RC0603_51_RoHS_L_4.pdf; ComponentLink2Description: http://www.yageo.com/documents/recent/PYu-RC0603_51_RoHS_L_4.pdf
S3 S4 = SW_THD_SPDT_On-On: as S1 on sheet Microcontroller; Circuit: SPDT; Mounting Type: PCB mount; Supplier 1: Compel; Supplier Part Number 1: 450-1598-ND; Switch Function: On-On; ComponentLink1URL: https://www.compel.ru/infosheet/TE/SLS121PC04
VD22 VD23 = DIODE_ZENER_4V_SOD323: as VD5 on sheet Peripherals; Package / Case: SOD-323; Diode Type: Zener; Supplier 1: Kompel; Supplier Part Number 1: MM3Z3V3ST1GOSCT-ND; ComponentLink1URL: https://www.compel.ru/infosheet/DIOTEC/MM3Z3V6
VD24 = SM24CANA: TVS Diode Array; Manufacture: Littelfuse; Model: SM24CANA-02HTG; HelpURL: https://www.compel.ru/wordpress/wp-content/uploads/2017/03/Littelfuse_SM24CANA.pdf; Case: DO-41
X6 = USB_TypeB: Connector THT Type B USB connector; Manufacturer Part Number 1: 0670680000; Manufacturer 1: Molex; Specifications: USB 2.0; SCDType: undef; ComponentLink1Designator: Compel; Package / Case: R/A Type B; Supplier 1: Digi-Key; Connector Type: USB - B; Supplier Part Number 1: A31725-ND; ComponentLink1URL: https://www.compel.ru/infosheet/MOL/0670680000
X7 X8 = CONN XBEE: Manufacture: CONNFLY; ComponentLink1Designator: Compel; ComponentLink1URL: https://www.compel.ru/infosheet/CONNFLY/PBS2-10; Model: PBS2-10
X9 = XBEE connector_left: External; Manufacture: NINGBO KLS Electronic Co.,Ltd.; HelpURL: https://www.compel.ru/infosheet/KLS/PBS-10; Case: *; Model: PBS10
X10 = XBEE connector: External; Manufacture: NINGBO KLS Electronic Co.,Ltd.; HelpURL: https://www.compel.ru/infosheet/KLS/PBS-10; Case: *; Model: PBS10
X11 = PLS-2 _1: as X3 on sheet Microcontroller; Model: PLS-2; HelpURL: https://www.compel.ru/infosheet/KLS/PLS-2
X12 = DRB-9FA_1: Conector CAN; Manufacture: Connfly; Model: DRB-9FA; Case: DB9; ComponentLink1Description: COMPEL; ComponentLink1URL: https://www.compel.ru/infosheet/CONNFLY/DRB-9FA
XW2-XW5 = CONN_BNC: as XW1 on sheet Peripherals; Category: Connectors; Mounting Type: Through Hole; Supplier 1: Digi-Key; Supplier Part Number 1: A32418-ND; ComponentLink1URL: https://www.compel.ru/infosheet/TE/413969-2; ComponentLink1Description: Compel

## Sheet Displays.SchDoc
size 420 x 297 mm; Address1: Address1; Address2: Address2; Address3: Address3; Address4: Address4; DocumentNumber: МЭИ.466219.001 Э3; SheetNumber: 3; Scale: 1:1; DocumentType: Схема электрическая принципиальная; FirstReferrence: АБВГ.123456.001
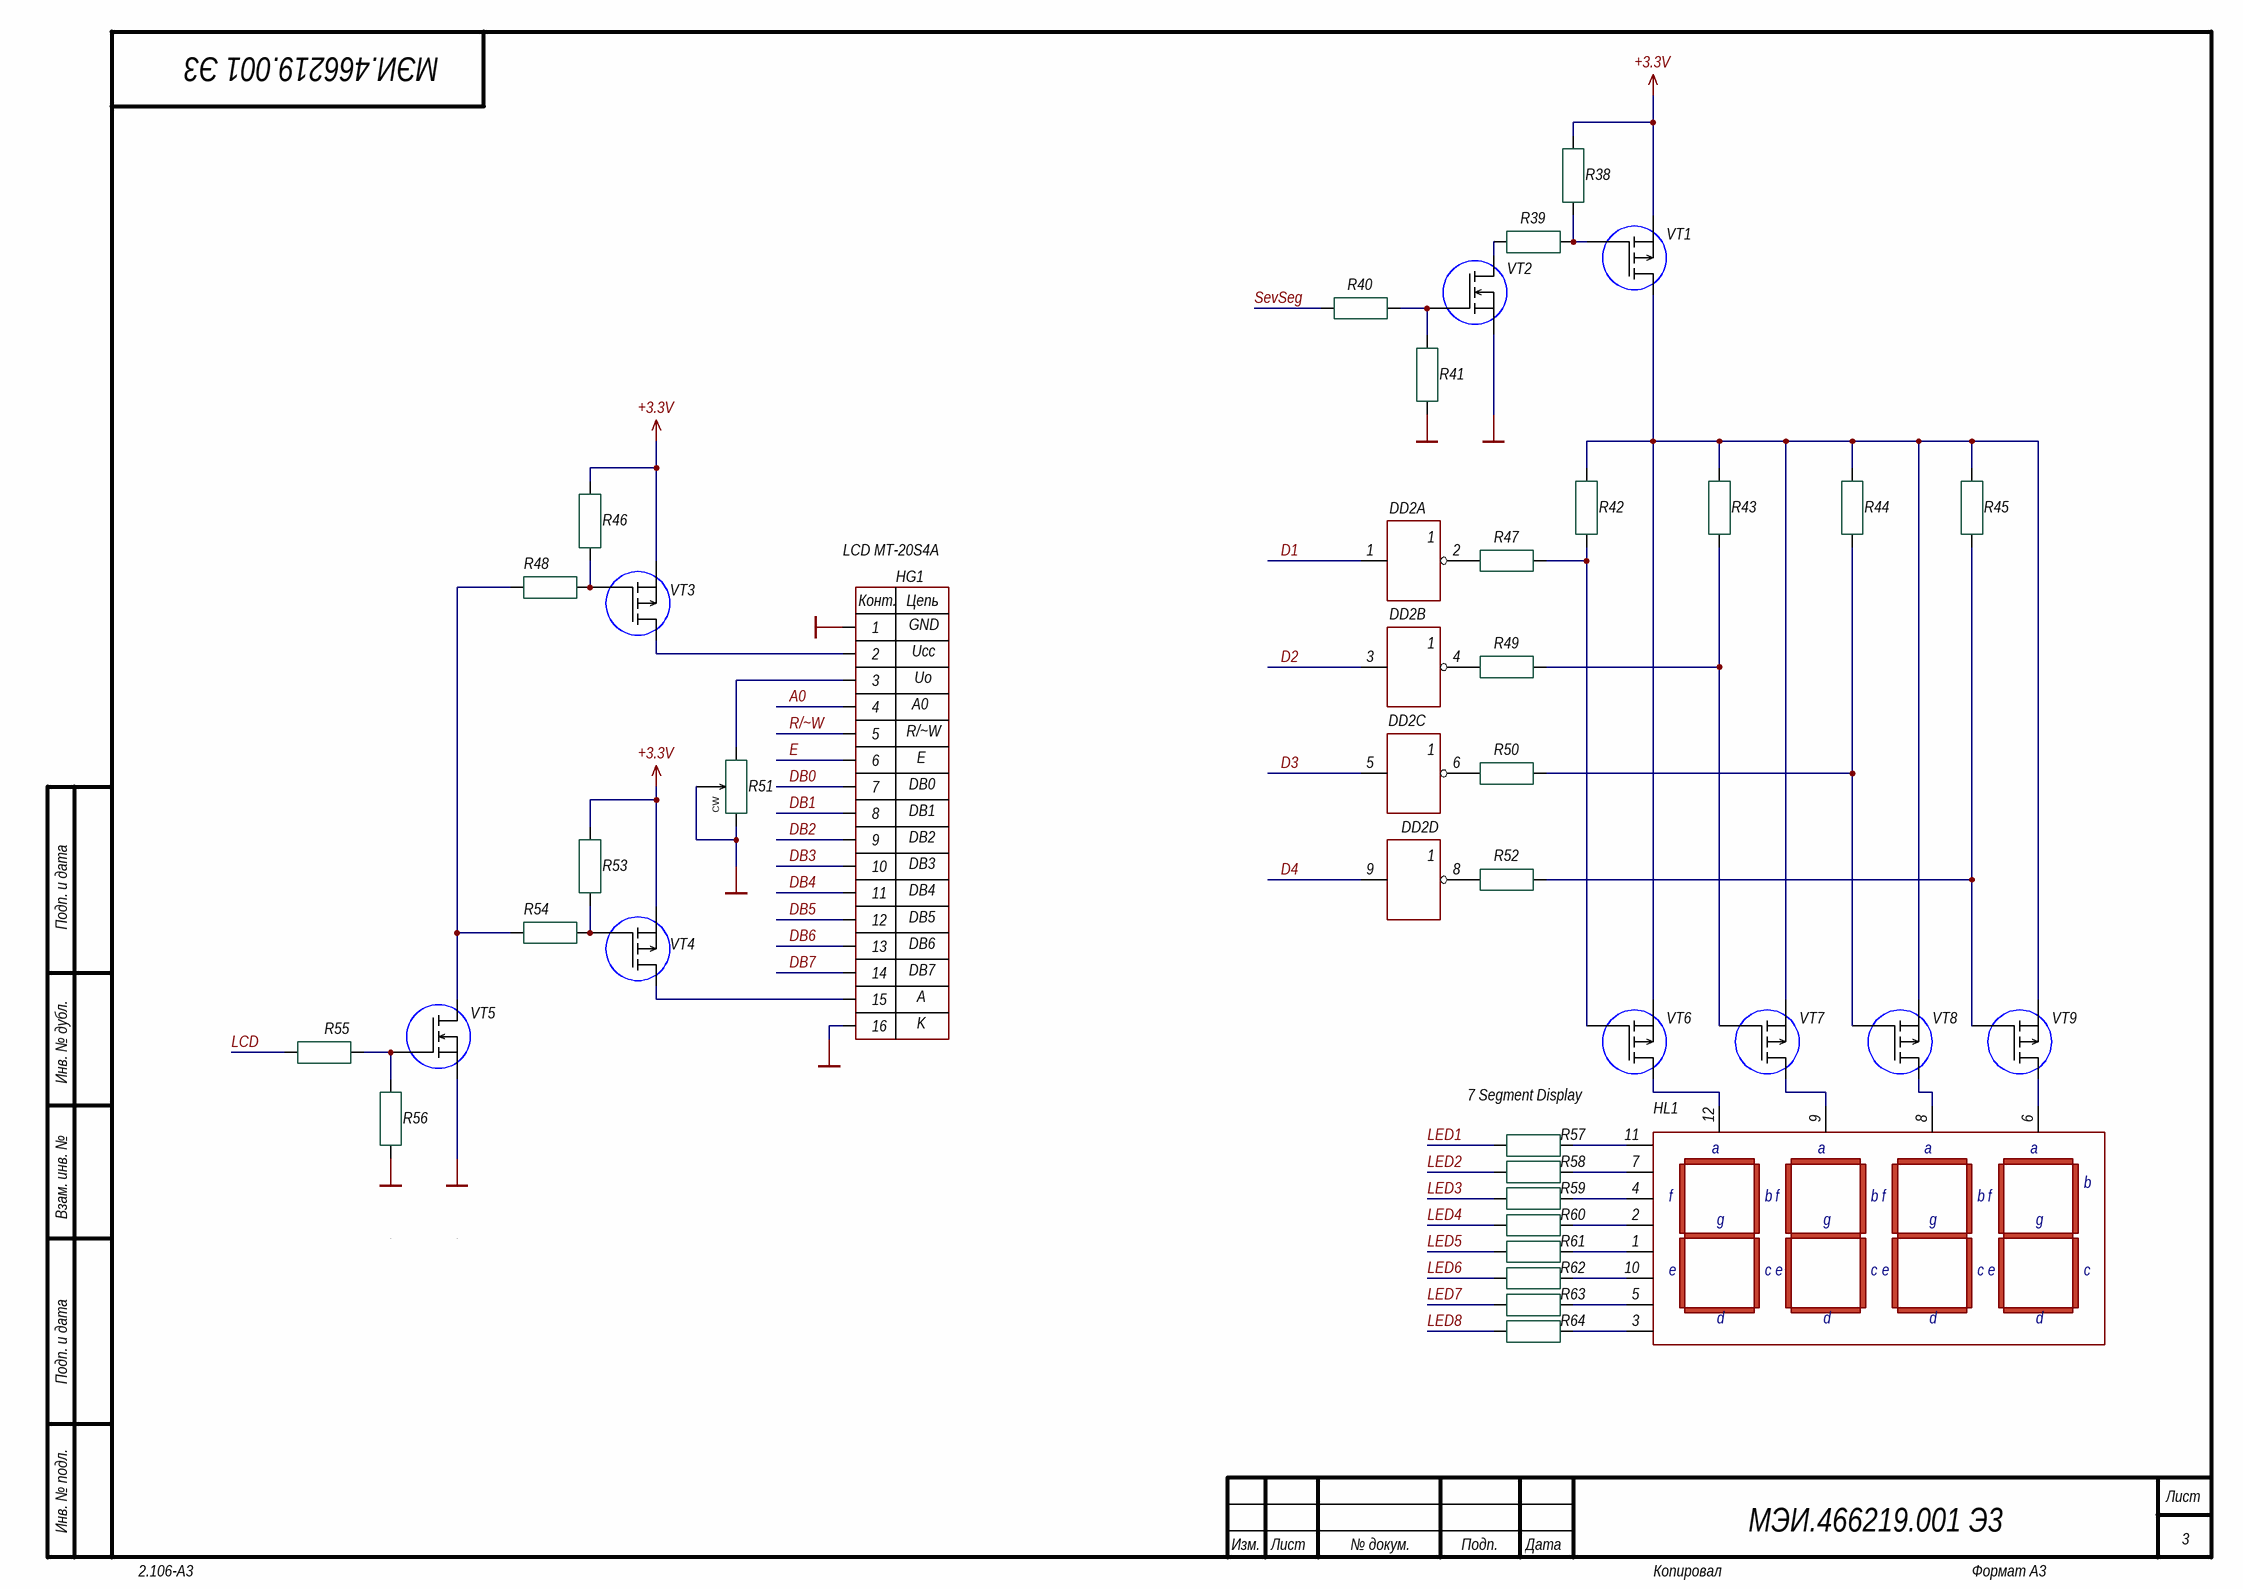
[diagram p3: Displays.SchDoc]

### Parts
DD2  SN74AHCU04DR  [SOIC127P780X200-14N]  (value not drawn)  (parts A,B,C,D of 7)
HG1  MT-20S4A-2YLG-3V0  [MT-20S4A]  (value not drawn)
HL1  CA56-12GWA  [CA56-12GWA]  (value not drawn)
R38  Thick Film  [RESC1608X55N]  (value not drawn)
R39  Thick Film  [RESC1608X55N]  (value not drawn)
R40  Thick Film  [RESC1608X55N]  (value not drawn)
R41  Thick Film  [RESC1608X55N]  (value not drawn)
R42  Thick Film  [RESC1608X55N]  (value not drawn)
R43  Thick Film  [RESC1608X55N]  (value not drawn)
R44  Thick Film  [RESC1608X55N]  (value not drawn)
R45  Thick Film  [RESC1608X55N]  (value not drawn)
R46  Thick Film  [RESC1608X55N]  (value not drawn)
R47  Thick Film  [RESC1608X55N]  (value not drawn)
R48  Thick Film  [RESC1608X55N]  (value not drawn)
R49  Thick Film  [RESC1608X55N]  (value not drawn)
R50  Thick Film  [RESC1608X55N]  (value not drawn)
R51  25 turns  [TrimPot_LCD]  (value not drawn)
R52  Thick Film  [RESC1608X55N]  (value not drawn)
R53  Thick Film  [RESC1608X55N]  (value not drawn)
R54  Thick Film  [RESC1608X55N]  (value not drawn)
R55  Thick Film  [RESC1608X55N]  (value not drawn)
R56  Thick Film  [RESC1608X55N]  (value not drawn)
R57  Thick Film  [RESC1608X55N]  (value not drawn)
R58  Thick Film  [RESC1608X55N]  (value not drawn)
R59  Thick Film  [RESC1608X55N]  (value not drawn)
R60  Thick Film  [RESC1608X55N]  (value not drawn)
R61  Thick Film  [RESC1608X55N]  (value not drawn)
R62  Thick Film  [RESC1608X55N]  (value not drawn)
R63  Thick Film  [RESC1608X55N]  (value not drawn)
R64  Thick Film  [RESC1608X55N]  (value not drawn)
VT1  IRLML2244  [SOT23-3-no_check]  (value not drawn)
VT2  IRLML6244  [SOT23-3-no_check]  (value not drawn)
VT3  IRLML2244  [SOT23-3-no_check]  (value not drawn)
VT4  IRLML2244  [SOT23-3-no_check]  (value not drawn)
VT5  IRLML6244  [SOT23-3-no_check]  (value not drawn)
VT6  IRLML2244  [SOT23-3-no_check]  (value not drawn)
VT7  IRLML2244  [SOT23-3-no_check]  (value not drawn)
VT8  IRLML2244  [SOT23-3-no_check]  (value not drawn)
VT9  IRLML2244  [SOT23-3-no_check]  (value not drawn)
X13  PBS-16R  [PBS16]  (value not drawn)
X14  PBS-16R  [PBS16]  (value not drawn)

### Nets
+3.3V: R38.2 R46.2 R53.2 VT1.2(S) VT3.2(S) VT4.2(S)
GND: HG1.1 HG1.16 R41.1 R51.CW R51.W R56.1 VT2.2(S) VT5.2(S)
A0: HG1.4
D1: DD2.1(1A)
D2: DD2.3(2A)
D3: DD2.5(3A)
D4: DD2.9(4A)
DB0: HG1.7
DB1: HG1.8
DB2: HG1.9
DB3: HG1.10
DB4: HG1.11
DB5: HG1.12
DB6: HG1.13
DB7: HG1.14
E: HG1.6
LCD: R55.1
LED1: R57.1
LED2: R58.1
LED3: R59.1
LED4: R60.1
LED5: R61.1
LED6: R62.1
LED7: R63.1
LED8: R64.1
R/~W: HG1.5
SevSeg: R40.1
NetDD2_2: DD2.2(1Y) R47.1
NetDD2_4: DD2.4(2Y) R49.1
NetDD2_6: DD2.6(3Y) R50.1
NetDD2_8: DD2.8(4Y) R52.1
NetHG1_2: HG1.2 VT3.3(D)
NetHG1_3: HG1.3 R51.CCW
NetHG1_15: HG1.15 VT4.3(D)
NetHL1_1: HL1.1(e) R61.2
NetHL1_2: HL1.2(d) R60.2
NetHL1_3: HL1.3(DP) R64.2
NetHL1_4: HL1.4(c) R59.2
NetHL1_5: HL1.5(g) R63.2
NetHL1_6: HL1.6(Dig4) VT9.3(D)
NetHL1_7: HL1.7(b) R58.2
NetHL1_8: HL1.8(Dig3) VT8.3(D)
NetHL1_9: HL1.9(Dig2) VT7.3(D)
NetHL1_10: HL1.10(f) R62.2
NetHL1_11: HL1.11(a) R57.2
NetHL1_12: HL1.12(Dig1) VT6.3(D)
NetR38_1: R38.1 R39.2 VT1.1(G)
NetR39_1: R39.1 VT2.3(D)
NetR40_2: R40.2 R41.2 VT2.1(G)
NetR42_1: R42.1 R47.2 VT6.1(G)
NetR42_2: R42.2 R43.2 R44.2 R45.2 VT1.3(D) VT6.2(S) VT7.2(S) VT8.2(S) VT9.2(S)
NetR43_1: R43.1 R49.2 VT7.1(G)
NetR44_1: R44.1 R50.2 VT8.1(G)
NetR45_1: R45.1 R52.2 VT9.1(G)
NetR46_1: R46.1 R48.2 VT3.1(G)
NetR48_1: R48.1 R54.1 VT5.3(D)
NetR53_1: R53.1 R54.2 VT4.1(G)
NetR55_2: R55.2 R56.2 VT5.1(G)

Not connected (* = marked no-connect by the designer): X13 1(VCC); X14 1(VCC)

### Notes on the sheet
- LCD MT-20S4A
- (near VT6) 7 Segment Display
- Подп. и дата
- Инв. № дубл.
- Взам. инв. №
- Инв. № подл.
- Изм.
- Лист
- № докум.
- Подп.
- Дата
- 2.106-A3
- Копировал
- Формат А3
- (in symbol MT-20S4A-2YLG-3V0) Конт.; Цепь; GND; Ucc; Uo; A0; R/~W; E; DB0; DB1; DB2; DB3; DB4; DB5; DB6; DB7; A; K

### Library data of the parts
DD2 = SN74AHCU04: HEX invertor; Manufacture: TI; HelpURL: https://www.compel.ru/infosheet/TI/SN74AHCU04D; Case: SO-14 (NS); Model: SN74AHCU04DR
HG1 = MT-20S4A-2YLG-3V0: LCD; Manufacture: МЭЛТ; HelpURL: http://www.melt.com.ru/docs/MT-20S4A.pdf; Case: *; Model: MT-20S4A-2YLG-3V0
HL1 = CA56-12GWA: Indicator; Manufacture: Kingbright; SYMBOL: 14.2mm; HelpURL: https://www.compel.ru/item-pdf/cf29282fff28ab60477c19c159e754de/pn/kgb~ca56-12gwa.pdf; Model: CA56-12GWA
R38 R41-R46 R53 R56 = RES_10K_0603_1%: as R5 on sheet Microcontroller; Package / Case: 0603 (1608 Metric); Supplier 1: Compel; Supplier Part Number 1: 311-10.0KHRCT-ND; Tolerance: ±1%; Value: 10K; ComponentLink1URL: https://www.compel.ru/infosheet/YAG/RC0603FR-0710KL
R39 R40 R47-R50 R52 R54 R55 = RES_470R_0603_5%: Resistor SMD chip 470 Ohm 0.1W 5% 0603; Manufacturer 1: Yageo; Manufacturer Part Number 1: CRCW0603470RJNEA; Ratings: 1/10 W; SCDType: spec; Value: 470R; ComponentLink1Designator: Compel; Package / Case: 0603 (1608 metric); Tolerance: ±5%; Material: Thick Film; Supplier 1: Compel; Supplier Part Number 1: 541-470GCT-ND; ComponentLink1URL: https://www.compel.ru/infosheet/YAG/RC0603FR-07470RL
R51 = RES_TRIMMER_10K_LCD: Trimmer THD 10K 500mW 25-turn; Manufacturer 1: Bourns; Manufacturer Part Number 1: 3266W-1-103; Tolerance: ±10%; Ratings: 250mW; ±100ppm/°C; ComponentLink1Designator: Compel; Material: *; Package / Case: 6.35×4.31×6.85; Supplier 1: Compel; Supplier Part Number 1: *; SCDType: *; ComponentLink1URL: https://www.compel.ru/infosheet/BOURNS/3266W-1-103; Value: 10K
R57-R64 = RES_68R_0603_5%: as R1 on sheet Microcontroller; Package / Case: 0603 (1608 metric); Material: Thick Film; Supplier 1: Compel; Supplier Part Number 1: 311-68GRCT-ND; ComponentLink1URL: https://www.compel.ru/infosheet/YAG/RC0603FR-0768RL
VT1 VT3 VT4 VT6-VT9 = MOSFET_P-CH_IRLML2244TRPbF: MOSFET P-Channel SMD; Manufacturer 1: Infineon; Ratings: 20V; 4.3A; SCDType: undef; Package / Case: SOT-23-3; Supplier 1: Compel; Supplier Part Number 1: IRLML2244TRPbF; ComponentLink1URL: https://www.compel.ru/item-pdf/b67edcdbc583bffdc43763720a97c5ae/ps/infin~irlml2246pbf.pdf; ComponentLink1Description: Data; ComponentLink2Description: Compel; ComponentLink2URL: https://www.compel.ru/infosheet/INFIN/IRLML2246TRPBF; Manufacturer Part Number 1: IRLML2244TRPbF
VT2 VT5 = MOSFET_N-CH_IRLML6244TRPBF: MOSFET N-Channel SMD; Manufacturer 1: Infineon; Ratings: 20V; 6.3A; SCDType: undef; Package / Case: SOT-23-3; Supplier 1: Compel; Supplier Part Number 1: IRLML6244TRPBF; ComponentLink1URL: https://www.compel.ru/item-pdf/c888608b045c7f9cf47a03db2a6506b1/ps/infin~irlml6244pbf.pdf; ComponentLink1Description: Data; ComponentLink2Description: Compel; ComponentLink2URL: https://www.compel.ru/infosheet/INFIN/IRLML6244TRPBF; Manufacturer Part Number 1: IRLML6244TRPBF
X13 X14 = CONN LCD: Manufacture: CONNFLY; ComponentLink1Designator: Compel; ComponentLink1URL: https://www.compel.ru/infosheet/CONNFLY/PBS-16R; Model: PBS-16R